# Altium project POETIC_Processor_V2.PrjPcb (part 1 of 2)
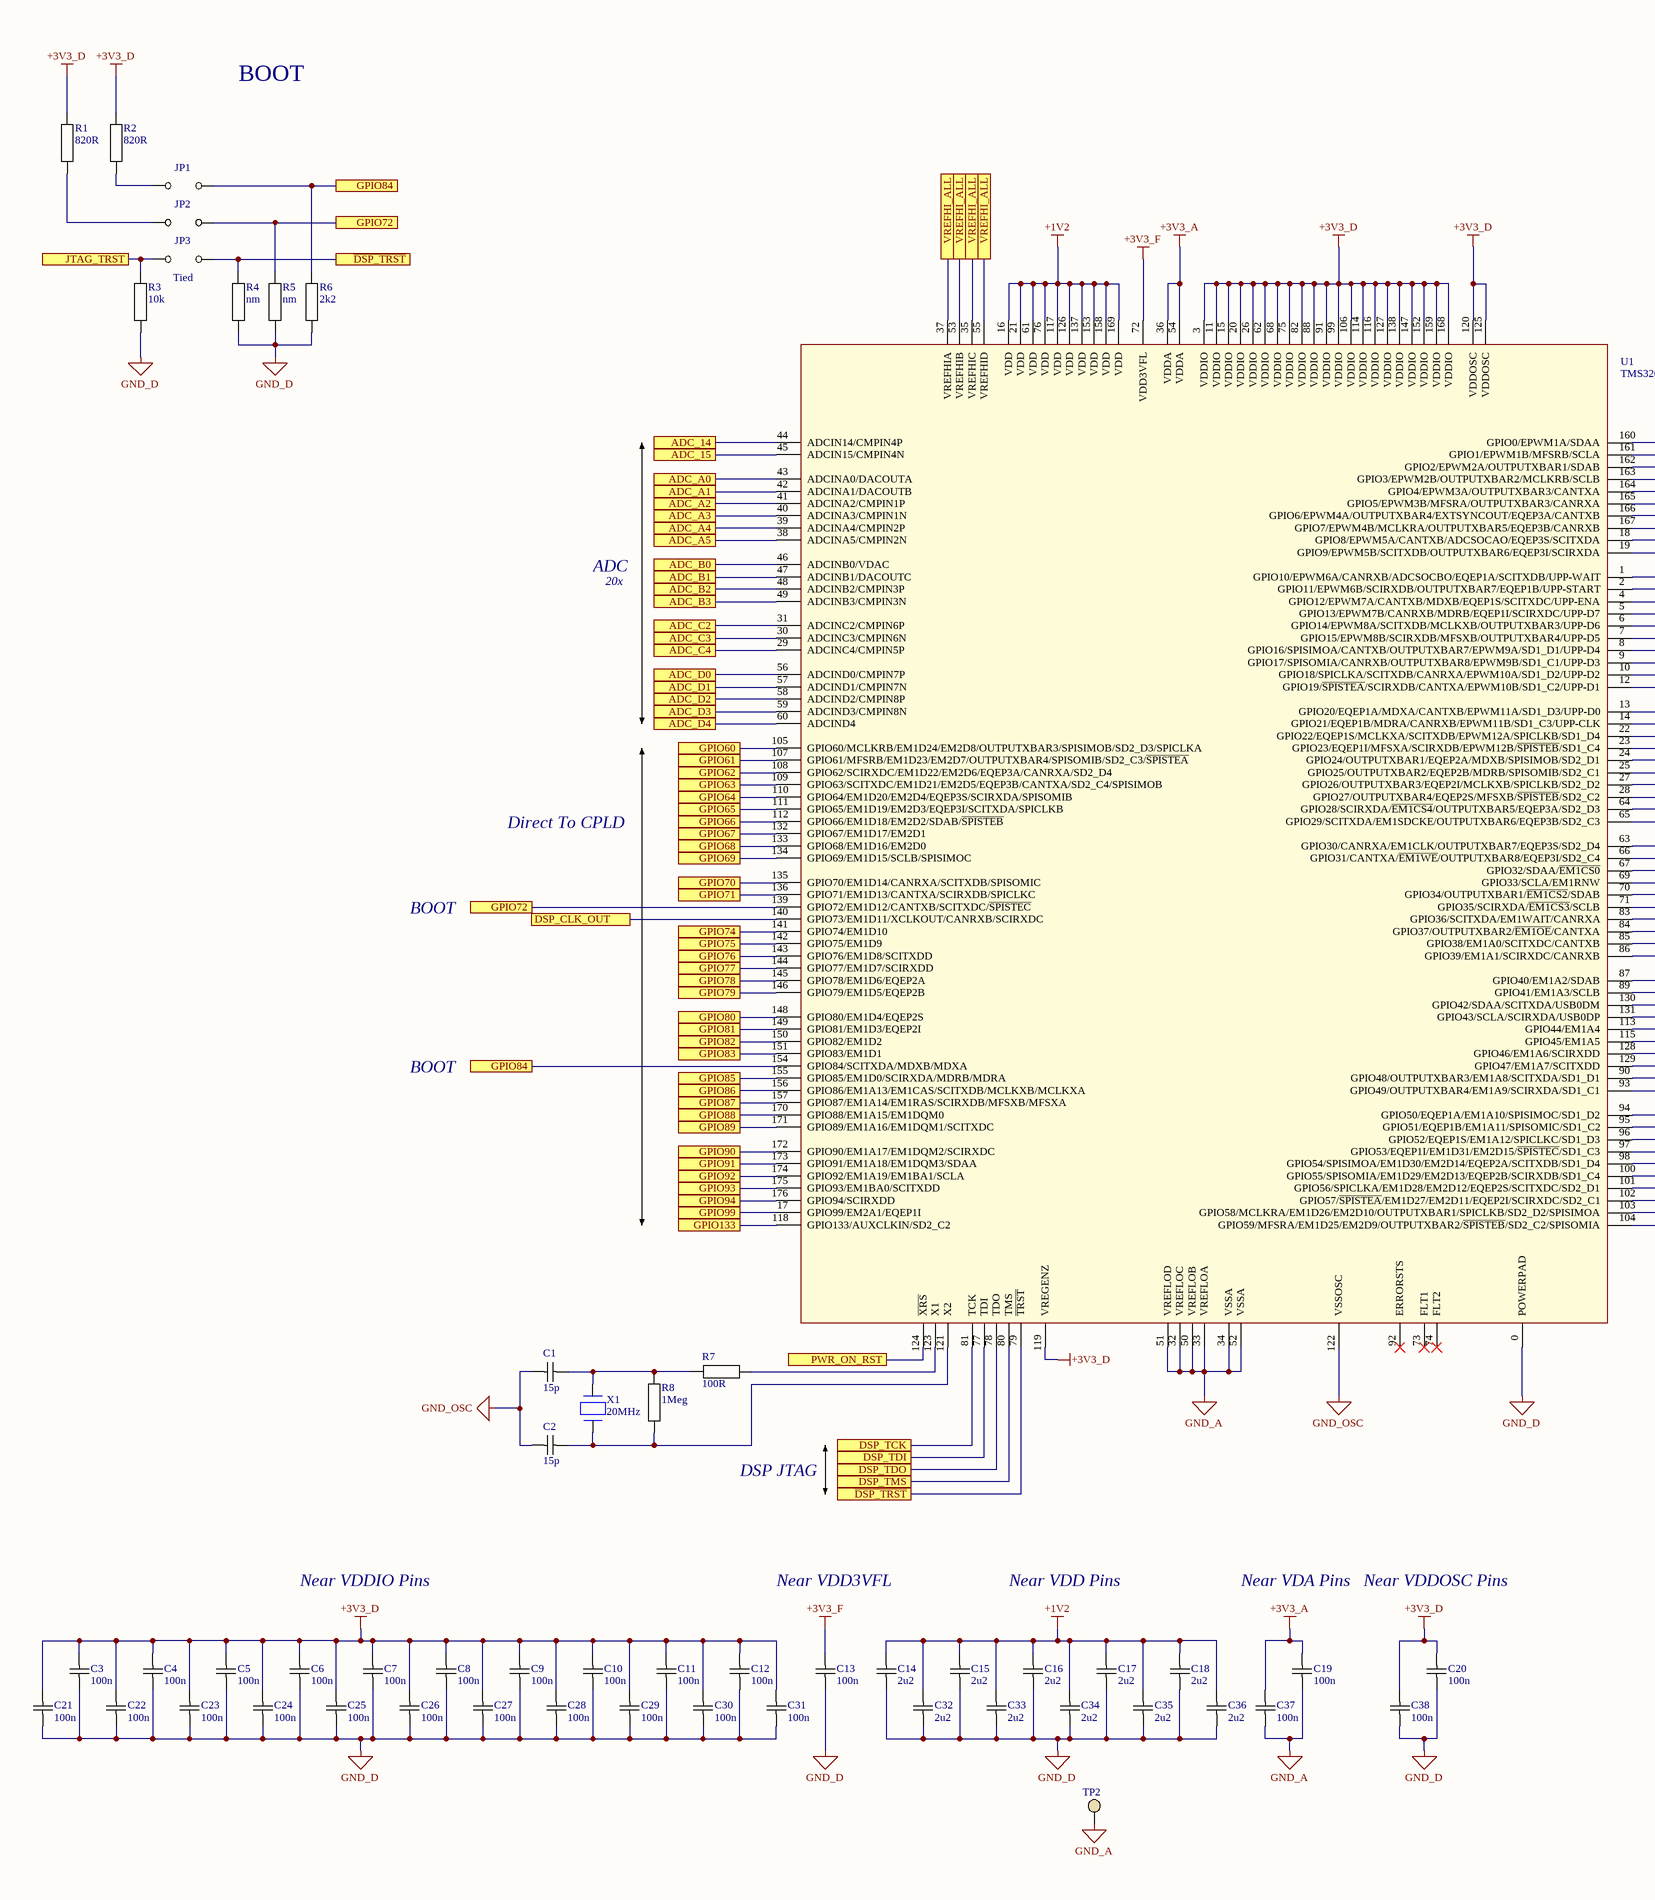
[diagram p0: Processor.SchDoc, left]
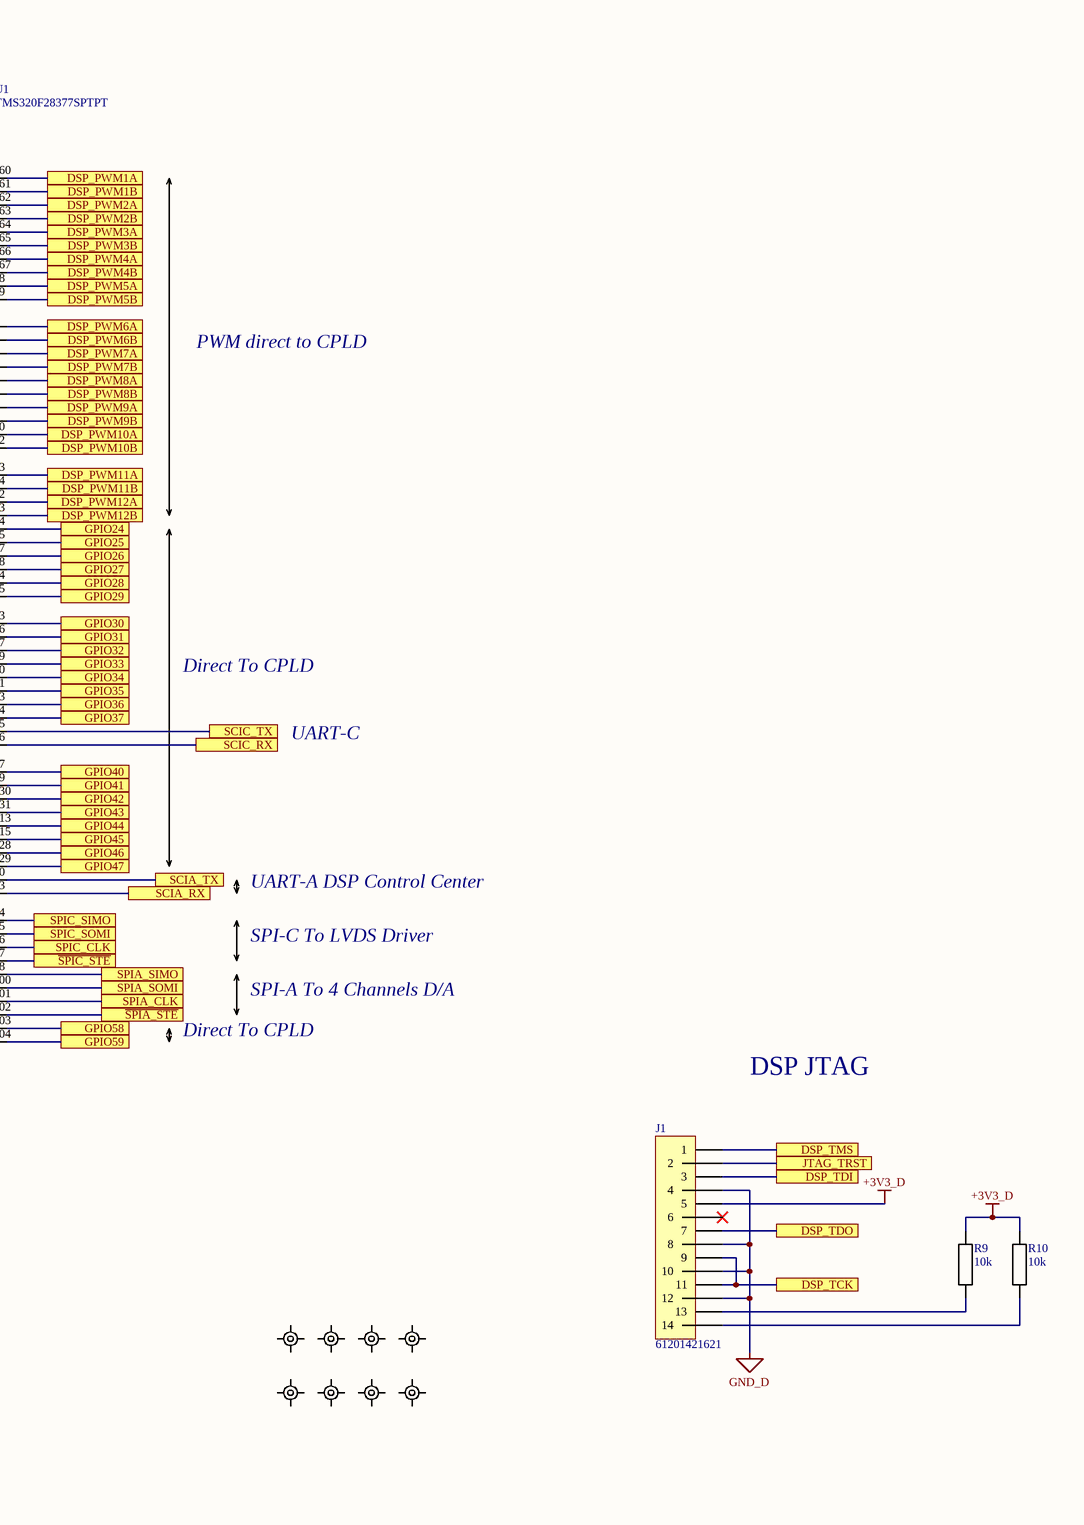
[diagram p1: Processor.SchDoc, right]
PcbDate: 13.03.2018; PcbDesigner: ARC; PcbRevision: 1.0; SchematicDate: 10.05.2019; SchematicDesigner: GIN/GEA; SchematicRevision: 2.0
8 sheets, 405 parts. Net scope: global (net labels, ports and power ports of the same name join across sheets).
Board files: POETIC_Processor_V2.PcbDoc, POETIC_Processor_V2_PANNEL.PcbDoc
Sheets:
  Processor.SchDoc
  Supply.SchDoc
  CPLD.SchDoc
  Connector_0.SchDoc
  AD_0.SchDoc
  AD_1.SchDoc
  AD_2.SchDoc
  Mezz_Board.SchDoc

## Sheet Processor.SchDoc
size A2; Date: Date; CompanyName: HESSO; Engineer: Name; Address1: Route du Rawyl 47; Address2: 1950 Sion; Address3: Switzerland; DocumentNumber: 1; SheetNumber: 1; SheetTotal: 8; ProjectName: Project Name

### Parts
C1  15p  [CAPACITOR 1608 REFLOW]
C2  15p  [CAPACITOR 1608 REFLOW]
C3  100n  [CAPACITOR 1608 REFLOW]
C4  100n  [CAPACITOR 1608 REFLOW]
C5  100n  [CAPACITOR 1608 REFLOW]
C6  100n  [CAPACITOR 1608 REFLOW]
C7  100n  [CAPACITOR 1608 REFLOW]
C8  100n  [CAPACITOR 1608 REFLOW]
C9  100n  [CAPACITOR 1608 REFLOW]
C10  100n  [CAPACITOR 1608 REFLOW]
C11  100n  [CAPACITOR 1608 REFLOW]
C12  100n  [CAPACITOR 1608 REFLOW]
C13  100n  [CAPACITOR 1608 REFLOW]
C14  2u2  [CAPACITOR 1608 REFLOW]
C15  2u2  [CAPACITOR 1608 REFLOW]
C16  2u2  [CAPACITOR 1608 REFLOW]
C17  2u2  [CAPACITOR 1608 REFLOW]
C18  2u2  [CAPACITOR 1608 REFLOW]
C19  100n  [CAPACITOR 1608 REFLOW]
C20  100n  [CAPACITOR 1608 REFLOW]
C21  100n  [CAPACITOR 1608 REFLOW]
C22  100n  [CAPACITOR 1608 REFLOW]
C23  100n  [CAPACITOR 1608 REFLOW]
C24  100n  [CAPACITOR 1608 REFLOW]
C25  100n  [CAPACITOR 1608 REFLOW]
C26  100n  [CAPACITOR 1608 REFLOW]
C27  100n  [CAPACITOR 1608 REFLOW]
C28  100n  [CAPACITOR 1608 REFLOW]
C29  100n  [CAPACITOR 1608 REFLOW]
C30  100n  [CAPACITOR 1608 REFLOW]
C31  100n  [CAPACITOR 1608 REFLOW]
C32  2u2  [CAPACITOR 1608 REFLOW]
C33  2u2  [CAPACITOR 1608 REFLOW]
C34  2u2  [CAPACITOR 1608 REFLOW]
C35  2u2  [CAPACITOR 1608 REFLOW]
C36  2u2  [CAPACITOR 1608 REFLOW]
C37  100n  [CAPACITOR 1608 REFLOW]
C38  100n  [CAPACITOR 1608 REFLOW]
J1  61201421621  [FlatCable2x7 2.54MM Straight TH]
JP1  Tied  [JUMPER2 SMD 1608]  (value not drawn)  (net tie, no BOM)
JP2  Tied  [JUMPER2 SMD 1608]  (value not drawn)  (net tie, no BOM)
JP3  Tied  [JUMPER2 SMD 1608]  (net tie, no BOM)
R1  820R  [RESISTOR 1608 REFLOW]
R2  820R  [RESISTOR 1608 REFLOW]
R3  10k  [RESISTOR 1608 REFLOW]
R4  nm  [RESISTOR 1608 REFLOW]
R5  nm  [RESISTOR 1608 REFLOW]
R6  2k2  [RESISTOR 1608 REFLOW]
R7  100R  [RESISTOR 1608 REFLOW]
R8  1Meg  [RESISTOR 1608 REFLOW]
R9  10k  [RESISTOR 1608 REFLOW]
R10  10k  [RESISTOR 1608 REFLOW]
TP2  *  [Test Point Keystone Miniature BLACK]  (value not drawn)
U1  TMS320F28377SPTPT  [PQFP176 P0.5 C24.2X24.2 H1.5]
X1  20MHz  [Quartz HC49/4H SMX]
Z1  1 - 3  [FIDUCIAL]  (value not drawn)
Z2  1 - 3  [FIDUCIAL]  (value not drawn)
Z3  1 - 3  [FIDUCIAL]  (value not drawn)
Z4  1 - 3  [FIDUCIAL]  (value not drawn)
Z5  1 - 3  [FIDUCIAL]  (value not drawn)
Z6  1 - 3  [FIDUCIAL]  (value not drawn)
Z7  1 - 3  [FIDUCIAL]  (value not drawn)
Z8  1 - 3  [FIDUCIAL]  (value not drawn)

### Ports
ADC_14, ADC_15, ADC_A0, ADC_A1, ADC_A2, ADC_A3, ADC_A4, ADC_A5, ADC_B0, ADC_B1, ADC_B2, ADC_B3, ADC_C2, ADC_C3, ADC_C4, ADC_D0, ADC_D1, ADC_D2, ADC_D3, ADC_D4, DSP_CLK_OUT, DSP_PWM1A, DSP_PWM1B, DSP_PWM2A, DSP_PWM2B, DSP_PWM3A, DSP_PWM3B, DSP_PWM4A, DSP_PWM4B, DSP_PWM5A, DSP_PWM5B, DSP_PWM6A, DSP_PWM6B, DSP_PWM7A, DSP_PWM7B, DSP_PWM8A, DSP_PWM8B, DSP_PWM9A, DSP_PWM9B, DSP_PWM10A, DSP_PWM10B, DSP_PWM11A, DSP_PWM11B, DSP_PWM12A, DSP_PWM12B, DSP_TCK, DSP_TDI, DSP_TDO, DSP_TMS, GPIO24, GPIO25, GPIO26, GPIO27, GPIO28, GPIO29, GPIO30, GPIO31, GPIO32, GPIO33, GPIO34, GPIO35, GPIO36, GPIO37, GPIO40, GPIO41, GPIO42, GPIO43, GPIO44, GPIO45, GPIO46, GPIO47, GPIO58, GPIO59, GPIO60, GPIO61, GPIO62, GPIO63, GPIO64, GPIO65, GPIO66, GPIO67, GPIO68, GPIO69, GPIO70, GPIO71, GPIO72, GPIO74, GPIO75, GPIO76, GPIO77, GPIO78, GPIO79, GPIO80, GPIO81, GPIO82, GPIO83, GPIO84, GPIO85, GPIO86, GPIO87, GPIO88, GPIO89, GPIO90, GPIO91, GPIO92, GPIO93, GPIO94, GPIO99, GPIO133, JTAG_TRST, PWR_ON_RST, SCIA_RX, SCIA_TX, SCIC_RX, SCIC_TX, SPIA_CLK, SPIA_SIMO, SPIA_SOMI, SPIC_CLK, SPIC_SIMO, SPIC_SOMI, VREFHI_ALL, ~{DSP_TRST}, ~{SPIA_STE}, ~{SPIC_STE}

### Nets
+1V2: C14.2 C15.2 C16.2 C17.2 C18.2 C32.2 C33.2 C34.2 C35.2 C36.2 U1.16(VDD) U1.21(VDD) U1.61(VDD) U1.76(VDD) U1.117(VDD) U1.126(VDD) U1.137(VDD) U1.153(VDD) U1.158(VDD) U1.169(VDD)
+3V3_A: C19.2 C37.2 U1.36(VDDA) U1.54(VDDA)
+3V3_D: C3.2 C4.2 C5.2 C6.2 C7.2 C8.2 C9.2 C10.2 C11.2 C12.2 C20.2 C21.2 C22.2 C23.2 C24.2 C25.2 C26.2 C27.2 C28.2 C29.2 C30.2 C31.2 C38.2 J1.5 R1.2 R2.2 R9.2 R10.2 U1.3(VDDIO) U1.11(VDDIO) U1.15(VDDIO) U1.20(VDDIO) U1.26(VDDIO) U1.62(VDDIO) U1.68(VDDIO) U1.75(VDDIO) U1.82(VDDIO) U1.88(VDDIO) U1.91(VDDIO) U1.99(VDDIO) U1.106(VDDIO) U1.114(VDDIO) U1.116(VDDIO) U1.119(VREGENZ) U1.120(VDDOSC) U1.125(VDDOSC) U1.127(VDDIO) U1.138(VDDIO) U1.147(VDDIO) U1.152(VDDIO) U1.159(VDDIO) U1.168(VDDIO)
+3V3_F: C13.2 U1.72(VDD3VFL)
GND_A: C19.1 C37.1 TP2.1 U1.32(VREFLOC) U1.33(VREFLOA) U1.34(VSSA) U1.50(VREFLOB) U1.51(VREFLOD) U1.52(VSSA)
GND_D: C3.1 C4.1 C5.1 C6.1 C7.1 C8.1 C9.1 C10.1 C11.1 C12.1 C13.1 C14.1 C15.1 C16.1 C17.1 C18.1 C20.1 C21.1 C22.1 C23.1 C24.1 C25.1 C26.1 C27.1 C28.1 C29.1 C30.1 C31.1 C32.1 C33.1 C34.1 C35.1 C36.1 C38.1 J1.4 J1.8 J1.10 J1.12 R3.1 R4.1 R5.1 R6.1 U1.0(POWERPAD)
GND_OSC: C1.1 C2.1 U1.122(VSSOSC)
~{SPIA_STE}: U1.102(GPIO57/~{SPISTEA}/EM1D27/EM2D11/EQEP2I/SCIRXDC/SD2_C1) ; port ~{SPIA_STE}
~{SPIC_STE}: U1.97(GPIO53/EQEP1I/EM1D31/EM2D15/~{SPISTEC}/SD1_C3) ; port ~{SPIC_STE}
ADC_14: U1.44(ADCIN14/CMPIN4P) ; port ADC_14
ADC_15: U1.45(ADCIN15/CMPIN4N) ; port ADC_15
ADC_A0: U1.43(ADCINA0/DACOUTA) ; port ADC_A0
ADC_A1: U1.42(ADCINA1/DACOUTB) ; port ADC_A1
ADC_A2: U1.41(ADCINA2/CMPIN1P) ; port ADC_A2
ADC_A3: U1.40(ADCINA3/CMPIN1N) ; port ADC_A3
ADC_A4: U1.39(ADCINA4/CMPIN2P) ; port ADC_A4
ADC_A5: U1.38(ADCINA5/CMPIN2N) ; port ADC_A5
ADC_B0: U1.46(ADCINB0/VDAC) ; port ADC_B0
ADC_B1: U1.47(ADCINB1/DACOUTC) ; port ADC_B1
ADC_B2: U1.48(ADCINB2/CMPIN3P) ; port ADC_B2
ADC_B3: U1.49(ADCINB3/CMPIN3N) ; port ADC_B3
ADC_C2: U1.31(ADCINC2/CMPIN6P) ; port ADC_C2
ADC_C3: U1.30(ADCINC3/CMPIN6N) ; port ADC_C3
ADC_C4: U1.29(ADCINC4/CMPIN5P) ; port ADC_C4
ADC_D0: U1.56(ADCIND0/CMPIN7P) ; port ADC_D0
ADC_D1: U1.57(ADCIND1/CMPIN7N) ; port ADC_D1
ADC_D2: U1.58(ADCIND2/CMPIN8P) ; port ADC_D2
ADC_D3: U1.59(ADCIND3/CMPIN8N) ; port ADC_D3
ADC_D4: U1.60(ADCIND4) ; port ADC_D4
~{DSP_TRST}: JP3.2 R4.2 U1.79(~{TRST}) ; port ~{DSP_TRST}
DSP_CLK_OUT: U1.140(GPIO73/EM1D11/XCLKOUT/CANRXB/SCIRXDC) ; port DSP_CLK_OUT
DSP_PWM1A: U1.160(GPIO0/EPWM1A/SDAA) ; port DSP_PWM1A
DSP_PWM1B: U1.161(GPIO1/EPWM1B/MFSRB/SCLA) ; port DSP_PWM1B
DSP_PWM2A: U1.162(GPIO2/EPWM2A/OUTPUTXBAR1/SDAB) ; port DSP_PWM2A
DSP_PWM2B: U1.163(GPIO3/EPWM2B/OUTPUTXBAR2/MCLKRB/SCLB) ; port DSP_PWM2B
DSP_PWM3A: U1.164(GPIO4/EPWM3A/OUTPUTXBAR3/CANTXA) ; port DSP_PWM3A
DSP_PWM3B: U1.165(GPIO5/EPWM3B/MFSRA/OUTPUTXBAR3/CANRXA) ; port DSP_PWM3B
DSP_PWM4A: U1.166(GPIO6/EPWM4A/OUTPUTXBAR4/EXTSYNCOUT/EQEP3A/CANTXB) ; port DSP_PWM4A
DSP_PWM4B: U1.167(GPIO7/EPWM4B/MCLKRA/OUTPUTXBAR5/EQEP3B/CANRXB) ; port DSP_PWM4B
DSP_PWM5A: U1.18(GPIO8/EPWM5A/CANTXB/ADCSOCAO/EQEP3S/SCITXDA) ; port DSP_PWM5A
DSP_PWM5B: U1.19(GPIO9/EPWM5B/SCITXDB/OUTPUTXBAR6/EQEP3I/SCIRXDA) ; port DSP_PWM5B
DSP_PWM6A: U1.1(GPIO10/EPWM6A/CANRXB/ADCSOCBO/EQEP1A/SCITXDB/UPP-WAIT) ; port DSP_PWM6A
DSP_PWM6B: U1.2(GPIO11/EPWM6B/SCIRXDB/OUTPUTXBAR7/EQEP1B/UPP-START) ; port DSP_PWM6B
DSP_PWM7A: U1.4(GPIO12/EPWM7A/CANTXB/MDXB/EQEP1S/SCITXDC/UPP-ENA) ; port DSP_PWM7A
DSP_PWM7B: U1.5(GPIO13/EPWM7B/CANRXB/MDRB/EQEP1I/SCIRXDC/UPP-D7) ; port DSP_PWM7B
DSP_PWM8A: U1.6(GPIO14/EPWM8A/SCITXDB/MCLKXB/OUTPUTXBAR3/UPP-D6) ; port DSP_PWM8A
DSP_PWM8B: U1.7(GPIO15/EPWM8B/SCIRXDB/MFSXB/OUTPUTXBAR4/UPP-D5) ; port DSP_PWM8B
DSP_PWM9A: U1.8(GPIO16/SPISIMOA/CANTXB/OUTPUTXBAR7/EPWM9A/SD1_D1/UPP-D4) ; port DSP_PWM9A
DSP_PWM9B: U1.9(GPIO17/SPISOMIA/CANRXB/OUTPUTXBAR8/EPWM9B/SD1_C1/UPP-D3) ; port DSP_PWM9B
DSP_PWM10A: U1.10(GPIO18/SPICLKA/SCITXDB/CANRXA/EPWM10A/SD1_D2/UPP-D2) ; port DSP_PWM10A
DSP_PWM10B: U1.12(GPIO19/~{SPISTEA}/SCIRXDB/CANTXA/EPWM10B/SD1_C2/UPP-D1) ; port DSP_PWM10B
DSP_PWM11A: U1.13(GPIO20/EQEP1A/MDXA/CANTXB/EPWM11A/SD1_D3/UPP-D0) ; port DSP_PWM11A
DSP_PWM11B: U1.14(GPIO21/EQEP1B/MDRA/CANRXB/EPWM11B/SD1_C3/UPP-CLK) ; port DSP_PWM11B
DSP_PWM12A: U1.22(GPIO22/EQEP1S/MCLKXA/SCITXDB/EPWM12A/SPICLKB/SD1_D4) ; port DSP_PWM12A
DSP_PWM12B: U1.23(GPIO23/EQEP1I/MFSXA/SCIRXDB/EPWM12B/~{SPISTEB}/SD1_C4) ; port DSP_PWM12B
DSP_TCK: J1.9 J1.11 U1.81(TCK) ; port DSP_TCK
DSP_TDI: J1.3 U1.77(TDI) ; port DSP_TDI
DSP_TDO: J1.7 U1.78(TDO) ; port DSP_TDO
DSP_TMS: J1.1 U1.80(TMS) ; port DSP_TMS
GPIO24: U1.24(GPIO24/OUTPUTXBAR1/EQEP2A/MDXB/SPISIMOB/SD2_D1) ; port GPIO24
GPIO25: U1.25(GPIO25/OUTPUTXBAR2/EQEP2B/MDRB/SPISOMIB/SD2_C1) ; port GPIO25
GPIO26: U1.27(GPIO26/OUTPUTXBAR3/EQEP2I/MCLKXB/SPICLKB/SD2_D2) ; port GPIO26
GPIO27: U1.28(GPIO27/OUTPUTXBAR4/EQEP2S/MFSXB/~{SPISTEB}/SD2_C2) ; port GPIO27
GPIO28: U1.64(GPIO28/SCIRXDA/~{EM1CS4}/OUTPUTXBAR5/EQEP3A/SD2_D3) ; port GPIO28
GPIO29: U1.65(GPIO29/SCITXDA/EM1SDCKE/OUTPUTXBAR6/EQEP3B/SD2_C3) ; port GPIO29
GPIO30: U1.63(GPIO30/CANRXA/EM1CLK/OUTPUTXBAR7/EQEP3S/SD2_D4) ; port GPIO30
GPIO31: U1.66(GPIO31/CANTXA/~{EM1WE}/OUTPUTXBAR8/EQEP3I/SD2_C4) ; port GPIO31
GPIO32: U1.67(GPIO32/SDAA/~{EM1CS0}) ; port GPIO32
GPIO33: U1.69(GPIO33/SCLA/EM1RNW) ; port GPIO33
GPIO34: U1.70(GPIO34/OUTPUTXBAR1/~{EM1CS2}/SDAB) ; port GPIO34
GPIO35: U1.71(GPIO35/SCIRXDA/~{EM1CS3}/SCLB) ; port GPIO35
GPIO36: U1.83(GPIO36/SCITXDA/EM1WAIT/CANRXA) ; port GPIO36
GPIO37: U1.84(GPIO37/OUTPUTXBAR2/~{EM1OE}/CANTXA) ; port GPIO37
GPIO40: U1.87(GPIO40/EM1A2/SDAB) ; port GPIO40
GPIO41: U1.89(GPIO41/EM1A3/SCLB) ; port GPIO41
GPIO42: U1.130(GPIO42/SDAA/SCITXDA/USB0DM) ; port GPIO42
GPIO43: U1.131(GPIO43/SCLA/SCIRXDA/USB0DP) ; port GPIO43
GPIO44: U1.113(GPIO44/EM1A4) ; port GPIO44
GPIO45: U1.115(GPIO45/EM1A5) ; port GPIO45
GPIO46: U1.128(GPIO46/EM1A6/SCIRXDD) ; port GPIO46
GPIO47: U1.129(GPIO47/EM1A7/SCITXDD) ; port GPIO47
GPIO58: U1.103(GPIO58/MCLKRA/EM1D26/EM2D10/OUTPUTXBAR1/SPICLKB/SD2_D2/SPISIMOA) ; port GPIO58
GPIO59: U1.104(GPIO59/MFSRA/EM1D25/EM2D9/OUTPUTXBAR2/~{SPISTEB}/SD2_C2/SPISOMIA) ; port GPIO59
GPIO60: U1.105(GPIO60/MCLKRB/EM1D24/EM2D8/OUTPUTXBAR3/SPISIMOB/SD2_D3/SPICLKA) ; port GPIO60
GPIO61: U1.107(GPIO61/MFSRB/EM1D23/EM2D7/OUTPUTXBAR4/SPISOMIB/SD2_C3/~{SPISTEA}) ; port GPIO61
GPIO62: U1.108(GPIO62/SCIRXDC/EM1D22/EM2D6/EQEP3A/CANRXA/SD2_D4) ; port GPIO62
GPIO63: U1.109(GPIO63/SCITXDC/EM1D21/EM2D5/EQEP3B/CANTXA/SD2_C4/SPISIMOB) ; port GPIO63
GPIO64: U1.110(GPIO64/EM1D20/EM2D4/EQEP3S/SCIRXDA/SPISOMIB) ; port GPIO64
GPIO65: U1.111(GPIO65/EM1D19/EM2D3/EQEP3I/SCITXDA/SPICLKB) ; port GPIO65
GPIO66: U1.112(GPIO66/EM1D18/EM2D2/SDAB/~{SPISTEB}) ; port GPIO66
GPIO67: U1.132(GPIO67/EM1D17/EM2D1) ; port GPIO67
GPIO68: U1.133(GPIO68/EM1D16/EM2D0) ; port GPIO68
GPIO69: U1.134(GPIO69/EM1D15/SCLB/SPISIMOC) ; port GPIO69
GPIO70: U1.135(GPIO70/EM1D14/CANRXA/SCITXDB/SPISOMIC) ; port GPIO70
GPIO71: U1.136(GPIO71/EM1D13/CANTXA/SCIRXDB/SPICLKC) ; port GPIO71
GPIO72: JP2.2 R5.2 U1.139(GPIO72/EM1D12/CANTXB/SCITXDC/~{SPISTEC}) ; port GPIO72
GPIO74: U1.141(GPIO74/EM1D10) ; port GPIO74
GPIO75: U1.142(GPIO75/EM1D9) ; port GPIO75
GPIO76: U1.143(GPIO76/EM1D8/SCITXDD) ; port GPIO76
GPIO77: U1.144(GPIO77/EM1D7/SCIRXDD) ; port GPIO77
GPIO78: U1.145(GPIO78/EM1D6/EQEP2A) ; port GPIO78
GPIO79: U1.146(GPIO79/EM1D5/EQEP2B) ; port GPIO79
GPIO80: U1.148(GPIO80/EM1D4/EQEP2S) ; port GPIO80
GPIO81: U1.149(GPIO81/EM1D3/EQEP2I) ; port GPIO81
GPIO82: U1.150(GPIO82/EM1D2) ; port GPIO82
GPIO83: U1.151(GPIO83/EM1D1) ; port GPIO83
GPIO84: JP1.2 R6.2 U1.154(GPIO84/SCITXDA/MDXB/MDXA) ; port GPIO84
GPIO85: U1.155(GPIO85/EM1D0/SCIRXDA/MDRB/MDRA) ; port GPIO85
GPIO86: U1.156(GPIO86/EM1A13/EM1CAS/SCITXDB/MCLKXB/MCLKXA) ; port GPIO86
GPIO87: U1.157(GPIO87/EM1A14/EM1RAS/SCIRXDB/MFSXB/MFSXA) ; port GPIO87
GPIO88: U1.170(GPIO88/EM1A15/EM1DQM0) ; port GPIO88
GPIO89: U1.171(GPIO89/EM1A16/EM1DQM1/SCITXDC) ; port GPIO89
GPIO90: U1.172(GPIO90/EM1A17/EM1DQM2/SCIRXDC) ; port GPIO90
GPIO91: U1.173(GPIO91/EM1A18/EM1DQM3/SDAA) ; port GPIO91
GPIO92: U1.174(GPIO92/EM1A19/EM1BA1/SCLA) ; port GPIO92
GPIO93: U1.175(GPIO93/EM1BA0/SCITXDD) ; port GPIO93
GPIO94: U1.176(GPIO94/SCIRXDD) ; port GPIO94
GPIO99: U1.17(GPIO99/EM2A1/EQEP1I) ; port GPIO99
GPIO133: U1.118(GPIO133/AUXCLKIN/SD2_C2) ; port GPIO133
JTAG_TRST: J1.2 JP3.1 R3.2 ; port JTAG_TRST
PWR_ON_RST: U1.124(~{XRS}) ; port PWR_ON_RST
SCIA_RX: U1.93(GPIO49/OUTPUTXBAR4/EM1A9/SCIRXDA/SD1_C1) ; port SCIA_RX
SCIA_TX: U1.90(GPIO48/OUTPUTXBAR3/EM1A8/SCITXDA/SD1_D1) ; port SCIA_TX
SCIC_RX: U1.86(GPIO39/EM1A1/SCIRXDC/CANRXB) ; port SCIC_RX
SCIC_TX: U1.85(GPIO38/EM1A0/SCITXDC/CANTXB) ; port SCIC_TX
SPIA_CLK: U1.101(GPIO56/SPICLKA/EM1D28/EM2D12/EQEP2S/SCITXDC/SD2_D1) ; port SPIA_CLK
SPIA_SIMO: U1.98(GPIO54/SPISIMOA/EM1D30/EM2D14/EQEP2A/SCITXDB/SD1_D4) ; port SPIA_SIMO
SPIA_SOMI: U1.100(GPIO55/SPISOMIA/EM1D29/EM2D13/EQEP2B/SCIRXDB/SD1_C4) ; port SPIA_SOMI
SPIC_CLK: U1.96(GPIO52/EQEP1S/EM1A12/SPICLKC/SD1_D3) ; port SPIC_CLK
SPIC_SIMO: U1.94(GPIO50/EQEP1A/EM1A10/SPISIMOC/SD1_D2) ; port SPIC_SIMO
SPIC_SOMI: U1.95(GPIO51/EQEP1B/EM1A11/SPISOMIC/SD1_C2) ; port SPIC_SOMI
VREFHI_ALL: U1.35(VREFHIC) U1.37(VREFHIA) U1.53(VREFHIB) U1.55(VREFHID) ; port VREFHI_ALL
NetC1_2: C1.2 R7.1 R8.2 X1.2
NetC2_2: C2.2 R8.1 U1.121(X2) X1.1
NetJ1_13: J1.13 R9.1
NetJ1_14: J1.14 R10.1
NetJP1_1: JP1.1 R2.1
NetJP2_1: JP2.1 R1.1
NetR7_2: R7.2 U1.123(X1)

Not connected (* = marked no-connect by the designer): J1 6*; U1 73(FLT1)* 74(FLT2)* 92(ERRORSTS)*

### Notes on the sheet
- BOOT
- ADC
- 20x
- PWM direct to CPLD
- Direct To CPLD
- UART-C
- SPI-C To LVDS Driver
- UART-A DSP Control Center
- SPI-A To 4 Channels D/A
- DSP JTAG
- Near VDDIO Pins
- Near VDD3VFL
- Near VDD Pins
- Near VDA Pins
- Near VDDOSC Pins
- Date :
- Revision :
- Sheet
- of
- Design by :

### Library data of the parts
C1-C13 C19-C31 C37 C38 = Capacitor: Capacitor X7R 10% 50V 1608(0603)
  C1 C2: Value: 15p
  C3-C13 C19-C31 C37 C38: Value: 100n
C14-C18 C32-C36 = Capacitor: Capacitor X7R 10% 10V 1608(0603); Value: 2u2
J1 = FlatCable2x7: Manufacturer: Wurth Elektronik; Mouser No.: 710-61201421621; Value: 61201421621
JP1-JP3 = JUMPER 2 POS: Value: Tied
R1-R10 = Resistor: Resistor 1% 50V 100mW 1608(0603)
  R1 R2: Value: 820R
  R3 R9 R10: Value: 10k
  R4 R5: Value: nm
  R6: Value: 2k2
  R7: Value: 100R
  R8: Value: 1Meg
TP2 = Test Point: Value: *
U1 = TMS320F28377S-176P: Manufacturer: Texas Instruments; Value: TMS320F28377SPTPT; Mouser No.: 595-MS320F28377SPTPT
X1 = Quartz HC49/4H SMX
Z1-Z8 = FIDUCIAL: FIDUCIAL Din 1mm Dout 3mm; Value: 1 - 3

## Sheet Supply.SchDoc
size A2; Date: Date; CompanyName: HESSO; Engineer: Name; Address1: Route du Rawyl 47; Address2: 1950 Sion; Address3: Switzerland; DocumentNumber: 2; SheetNumber: 2; SheetTotal: 8; ProjectName: Project Name
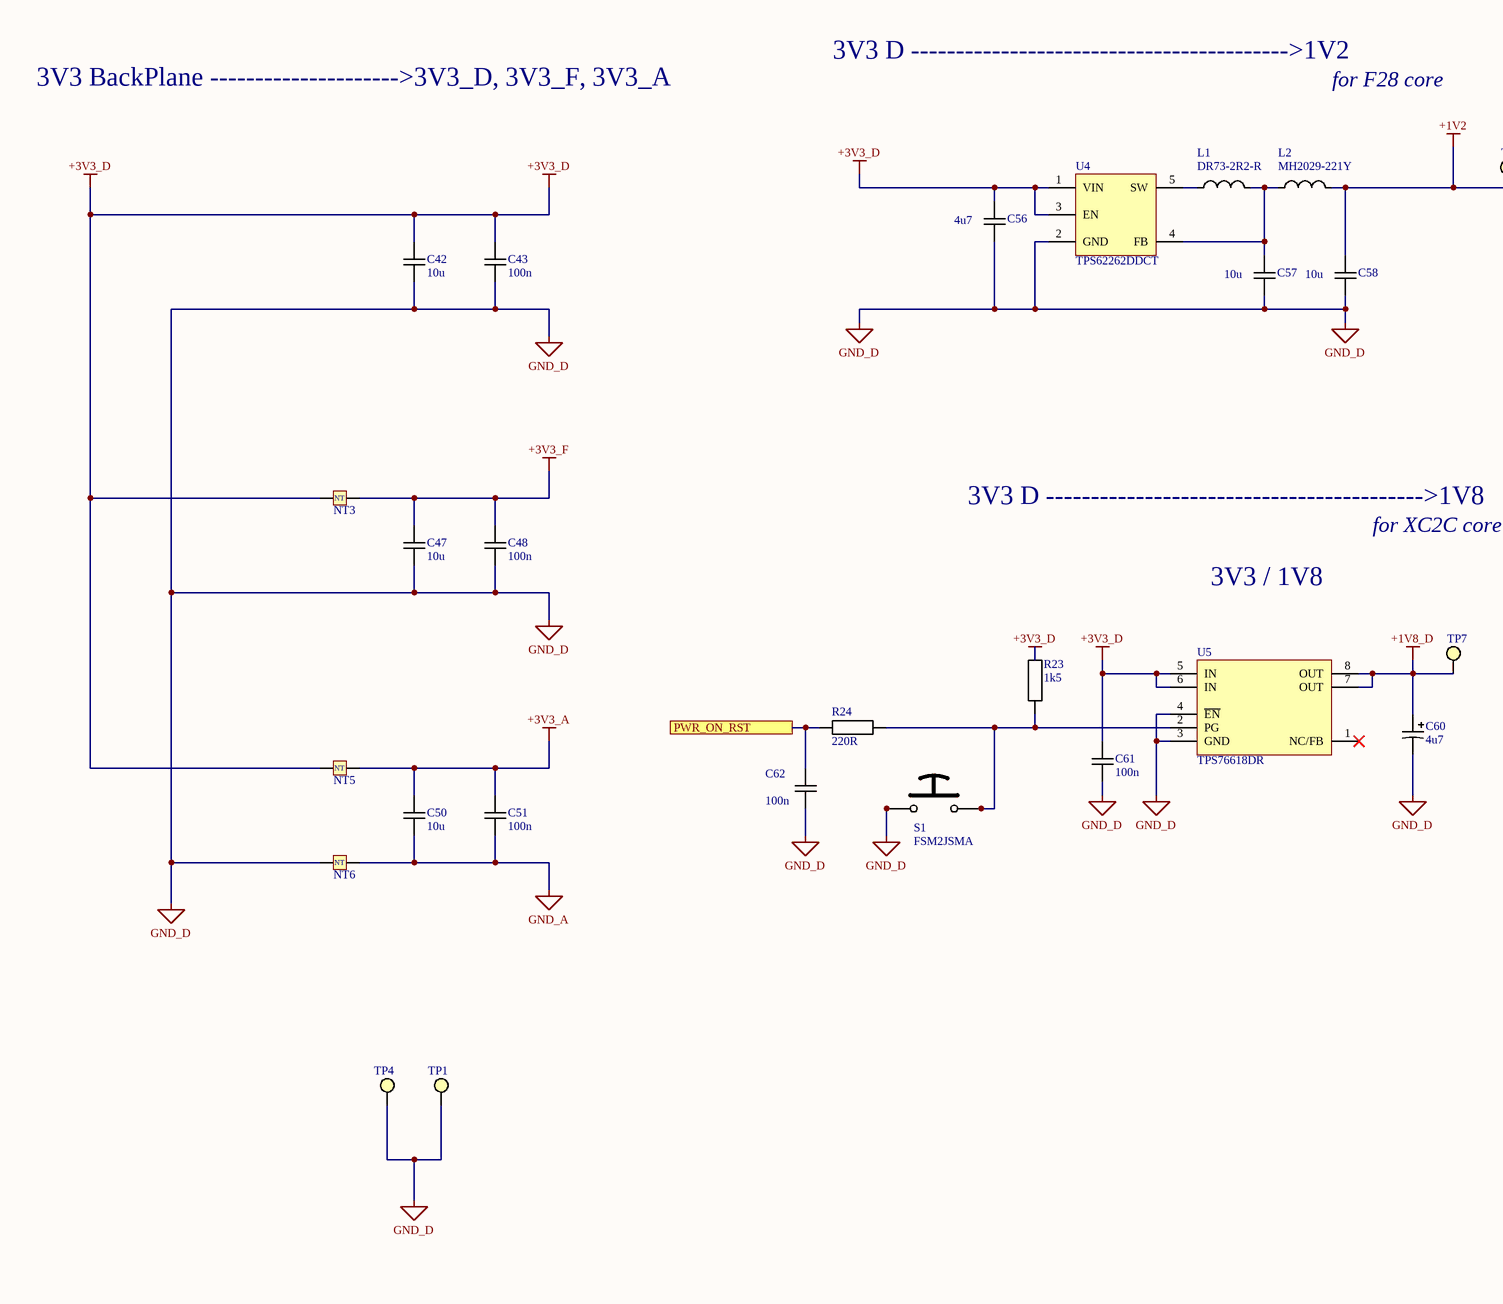
[diagram p2: Supply.SchDoc, left]
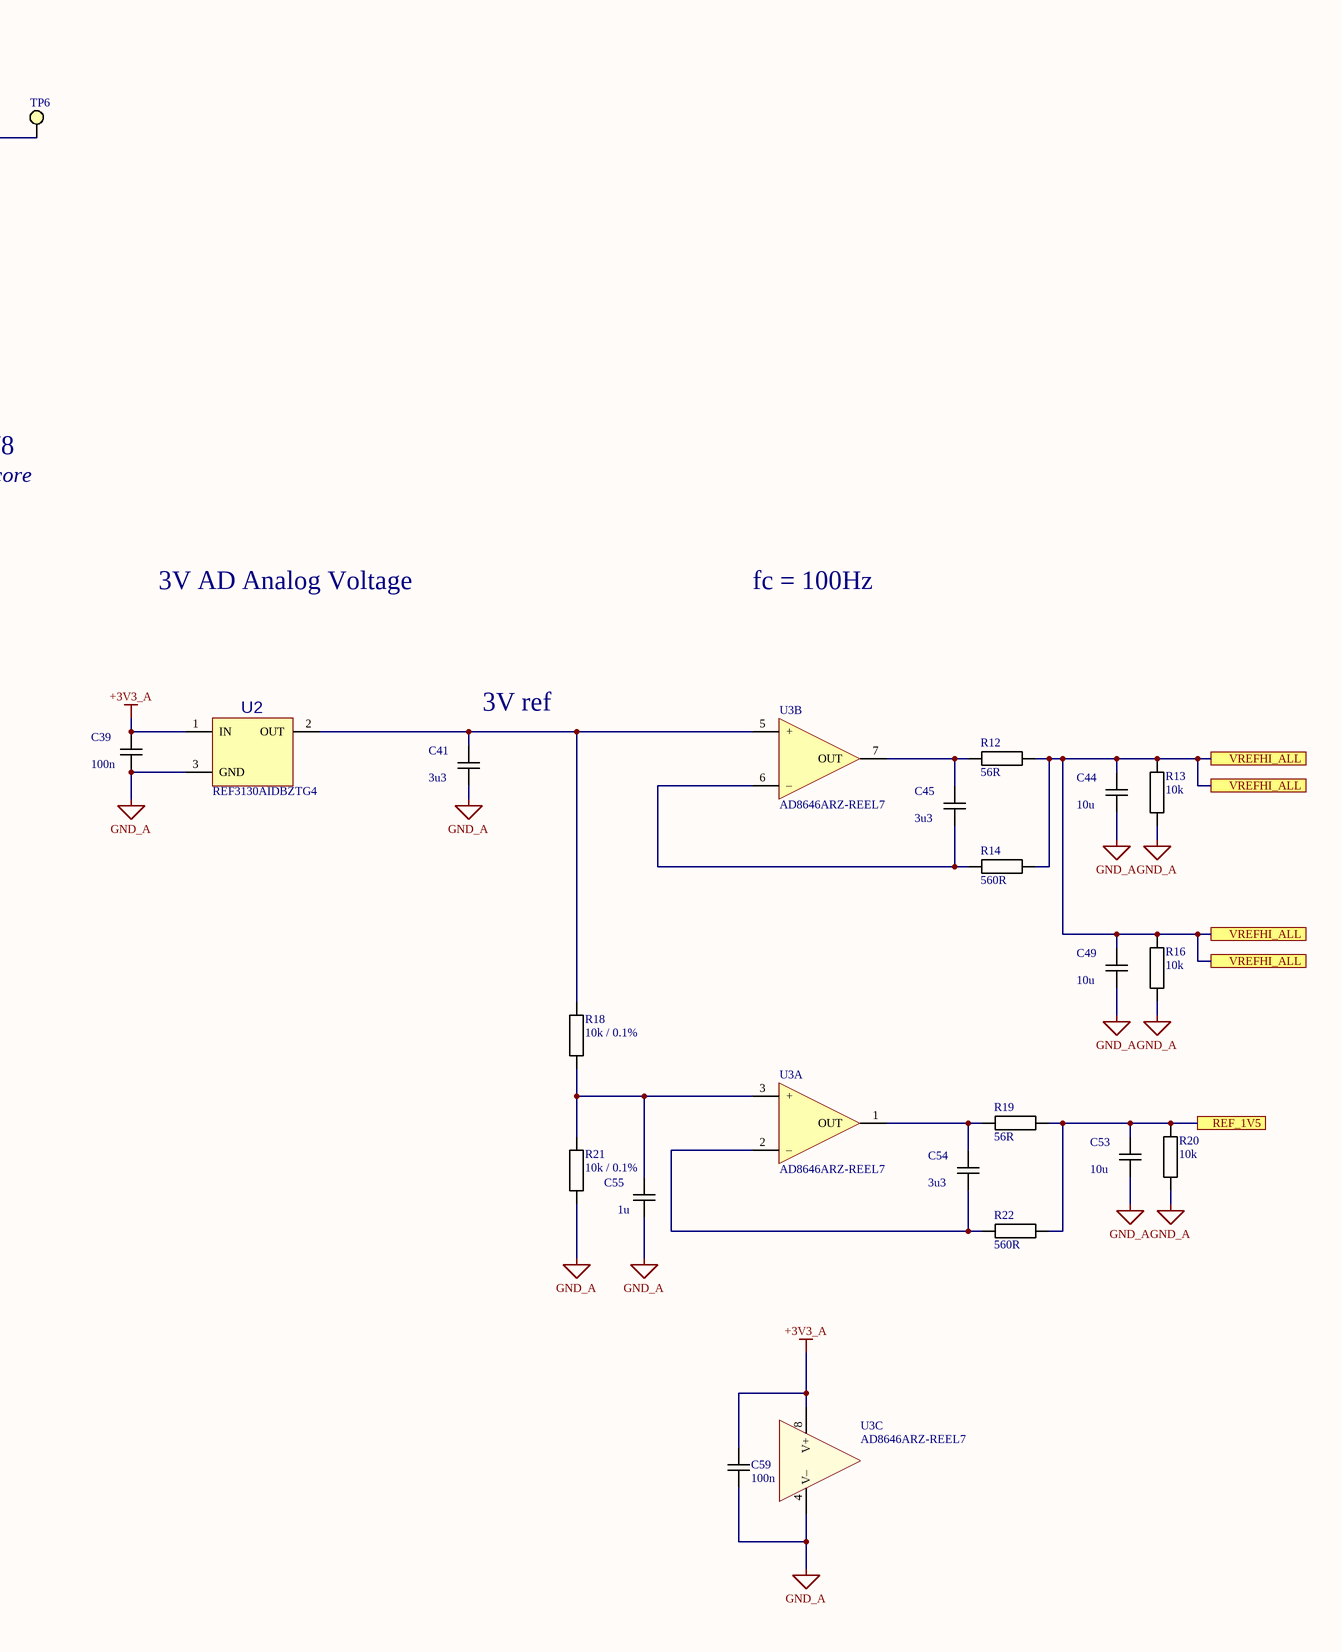
[diagram p3: Supply.SchDoc, right]

### Parts
C39  100n  [CAPACITOR 1608 REFLOW]
C41  3u3  [CAPACITOR 2012 REFLOW]
C42  10u  [CAPACITOR 2012 REFLOW]
C43  100n  [CAPACITOR 2012 REFLOW]
C44  10u  [CAPACITOR 2012 REFLOW]
C45  3u3  [CAPACITOR 2012 REFLOW]
C47  10u  [CAPACITOR 2012 REFLOW]
C48  100n  [CAPACITOR 2012 REFLOW]
C49  10u  [CAPACITOR 2012 REFLOW]
C50  10u  [CAPACITOR 2012 REFLOW]
C51  100n  [CAPACITOR 2012 REFLOW]
C53  10u  [CAPACITOR 2012 REFLOW]
C54  3u3  [CAPACITOR 2012 REFLOW]
C55  1u  [CAPACITOR 2012 REFLOW]
C56  4u7  [CAPACITOR 2012 REFLOW]
C57  10u  [CAPACITOR 2012 REFLOW]
C58  10u  [CAPACITOR 2012 REFLOW]
C59  100n  [CAPACITOR 1608 REFLOW]
C60  4u7  [CAPACITOR POL 3528-21 REFLOW]
C61  100n  [CAPACITOR 1608 REFLOW]
C62  100n  [CAPACITOR 1608 REFLOW]
L1  DR73-2R2-R  [DR73]
L2  MH2029-221Y  [INDUCTOR 2012 REFLOW]
NT3  Net Tie  [NET TIE 1005]  (value not drawn)  (net tie, no BOM)
NT5  Net Tie  [NET TIE 1005]  (value not drawn)  (net tie, no BOM)
NT6  Net Tie  [NET TIE 1005]  (value not drawn)  (net tie, no BOM)
R12  56R  [RESISTOR 1608 REFLOW]
R13  10k  [RESISTOR 1608 REFLOW]
R14  560R  [RESISTOR 1608 REFLOW]
R16  10k  [RESISTOR 1608 REFLOW]
R18  10k / 0.1%  [RESISTOR 1608 REFLOW]
R19  56R  [RESISTOR 1608 REFLOW]
R20  10k  [RESISTOR 1608 REFLOW]
R21  10k / 0.1%  [RESISTOR 1608 REFLOW]
R22  560R  [RESISTOR 1608 REFLOW]
R23  1k5  [RESISTOR 1608 REFLOW]
R24  220R  [RESISTOR 1608 REFLOW]
S1  FSM2JSMA  [Push Button C6.0x6.0 TE FSM-2J-SMA]
TP1  *  [Test Point Keystone Miniature BLACK]  (value not drawn)
TP4  *  [Test Point Keystone Miniature BLACK]  (value not drawn)
TP6  *  [Hole 1.0 D2.0]  (value not drawn)  (no BOM)
TP7  *  [Hole 1.0 D2.0]  (value not drawn)  (no BOM)
U2  REF3130AIDBZTG4  [SOT23 P0.95 C1.6x3.0 H1.3]
U3  AD8646ARZ-REEL7  [SO8 P1.27 C4.0X5.0 H1.75]  (parts A,B,C of 3)
U4  TPS62262DDCT  [SOT23-5 P0.95 C1.6x3.0 H1.3]
U5  TPS76618DR  [SO8 P1.27 C4.0X5.0 H1.75]

### Ports
PWR_ON_RST, REF_1V5, VREFHI_ALL

### Nets
+1V2: C58.2 L2.2 TP6.1
+1V8_D: C60.1 TP7.1 U5.7(OUT) U5.8(OUT)
+3V3_A: C39.2 C50.1 C51.1 C59.2 NT5.2 U2.1(IN) U3.8(V+)
+3V3_D: C42.1 C43.1 C56.2 C61.1 NT3.1 NT5.1 R23.2 U4.1(VIN) U4.3(EN) U5.5(IN) U5.6(IN)
+3V3_F: C47.1 C48.1 NT3.2
GND_A: C39.1 C41.1 C44.1 C49.1 C50.2 C51.2 C53.1 C55.1 C59.1 NT6.2 R13.2 R16.2 R20.2 R21.2 U2.3(GND) U3.4(V–)
GND_D: C42.2 C43.2 C47.2 C48.2 C56.1 C57.1 C58.1 C60.2 C61.2 C62.1 NT6.1 S1.1 S1.2 TP1.1 TP4.1 U4.2(GND) U5.3(GND) U5.4(~{EN})
PWR_ON_RST: C62.2 R24.1 ; port PWR_ON_RST
REF_1V5: C53.2 R19.1 R20.1 R22.1 ; port REF_1V5
VREFHI_ALL: C44.2 C49.2 R12.1 R13.1 R14.1 R16.1 ; port VREFHI_ALL
NetC41_2: C41.2 R18.2 U2.2(OUT) U3.5(+)
NetC45_1: C45.1 R14.2 U3.6(–)
NetC45_2: C45.2 R12.2 U3.7(OUT)
NetC54_1: C54.1 R22.2 U3.2(–)
NetC54_2: C54.2 R19.2 U3.1(OUT)
NetC55_2: C55.2 R18.1 R21.1 U3.3(+)
NetC57_2: C57.2 L1.2 L2.1 U4.4(FB)
NetL1_1: L1.1 U4.5(SW)
NetR23_1: R23.1 R24.2 S1.3 S1.4 U5.2(PG)

Not connected (* = marked no-connect by the designer): U5 1(NC/FB)*

### Notes on the sheet
- 3V3 D ------------------------------------------>1V2
- 3V3 BackPlane --------------------->3V3_D, 3V3_F, 3V3_A
- for F28 core
- 3V3 D ------------------------------------------>1V8
- for XC2C core
- 3V3 / 1V8
- 3V AD Analog Voltage
- fc = 100Hz
- (near C41) 3V ref
- Date :
- Revision :
- Sheet
- of
- Design by :
- (in symbol Net Tie) NT

### Library data of the parts
C39 C59 C61 C62 = Capacitor: Capacitor X7R 10% 50V 1608(0603); Value: 100n
C41 C42 C44 C45 C47 C49 C50 C53-C58 = Capacitor: Capacitor X7R 10% 10V 2012(0805)
  C41 C45 C54: Value: 3u3
  C42 C44 C47 C49 C50 C53 C57 C58: Value: 10u
  C55: Value: 1u
  C56: Value: 4u7
C43 C48 C51 = Capacitor: Capacitor X7R 10% 50V 2012(0805); Value: 100n
C60 = Capacitor Polarized: Capacitor Tantalum 10 % 10V 3528(1311-TAJ-B); Value: 4u7
L1 = Inductor: Manufacturer: Coiltronics / Eaton; Info: 2u2, 4.15A, 16mΩ; Mouser No.: 704-DR73-2R2-R; Value: DR73-2R2-R
L2 = Inductor: Manufacturer: Bourns; Info: 220u, 2A, 220Ω@100Mhz; Mouser No.: 652-MH2029-221Y; Value: MH2029-221Y
NT3 NT5 NT6 = Net Tie: Connection for 2 different NETNAME
R12-R14 R16 R18-R24 = Resistor: Resistor 1% 50V 100mW 1608(0603)
  R12 R19: Value: 56R
  R13 R16 R20: Value: 10k
  R14 R22: Value: 560R
  R18 R21: Value: 10k / 0.1%
  R23: Value: 1k5
  R24: Value: 220R
S1 = Push Button 4Pins: Push Button, 4 pins, 2 poles parrallèle; Manufacturer: TE Connectivity / Alcoswitch; Value: FSM2JSMA; Mouser No.: 506-FSM2JSMA
TP1 TP4 = Test Point: Value: *
TP6 TP7 = Hole: Value: *
U2 = REFERENCE SOT23 IN-OUT- GND: Generic Positive Voltage Reference; Manufacturer: Texas Instruments; Value: REF3130AIDBZTG4; Mouser No.: 595-REF3130AIDBZTG4
U3 = OPA DUAL: Generic dual OPA 8 pins; Manufacturer: Analog Devices; Value: AD8646ARZ-REEL7; Mouser No.: 584-AD8646ARZ-R7
U4 = TPS6226x: 2.25-MHz 600-mA Step Down Converter in 2 x 2 SOT Package; Manufacturer: Texas Instruments; Value: TPS62262DDCT; Mouser No.: 595-TPS62262DDCT
U5 = TPS766__D: Ultra Low Quiescent Current 250mA, Low Dropout Regulator; Manufacturer: Texas Instruments; Value: TPS76618DR; Mouser No.: 595-TPS76618DR

## Sheet CPLD.SchDoc
size A2; Date: Date; CompanyName: HESSO; Engineer: Name; Address1: Route du Rawyl 47; Address2: 1950 Sion; Address3: Switzerland; DocumentNumber: 3; SheetNumber: 3; SheetTotal: 8; ProjectName: Project Name
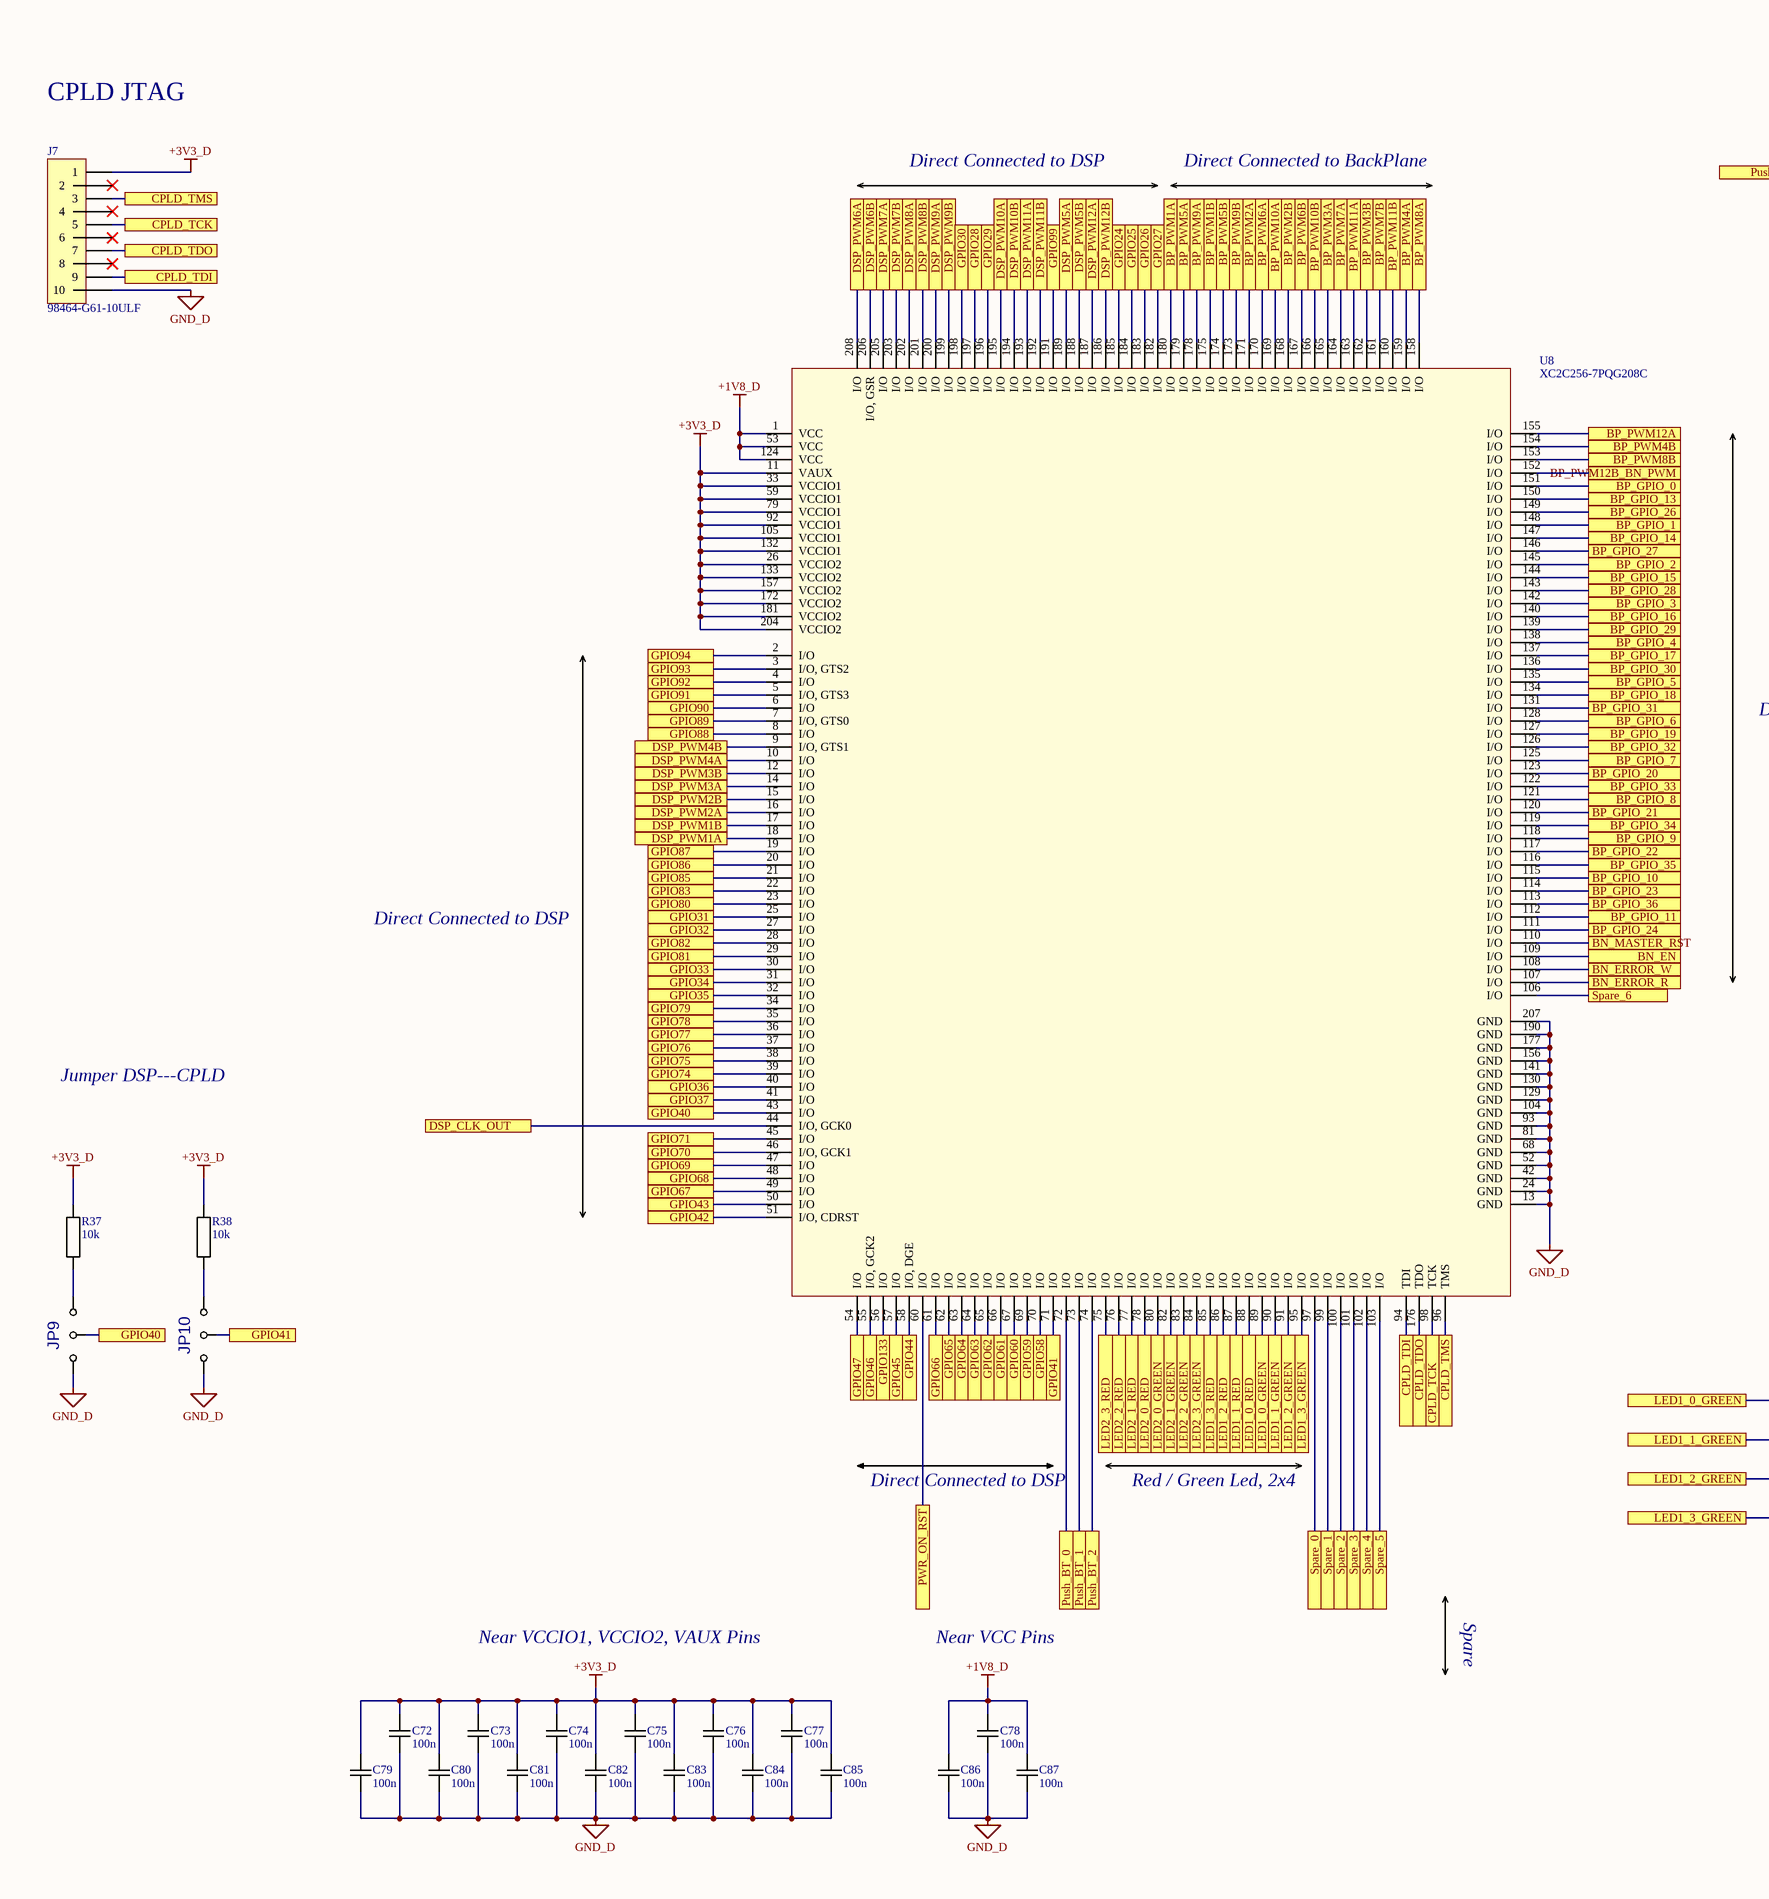
[diagram p4: CPLD.SchDoc, left]
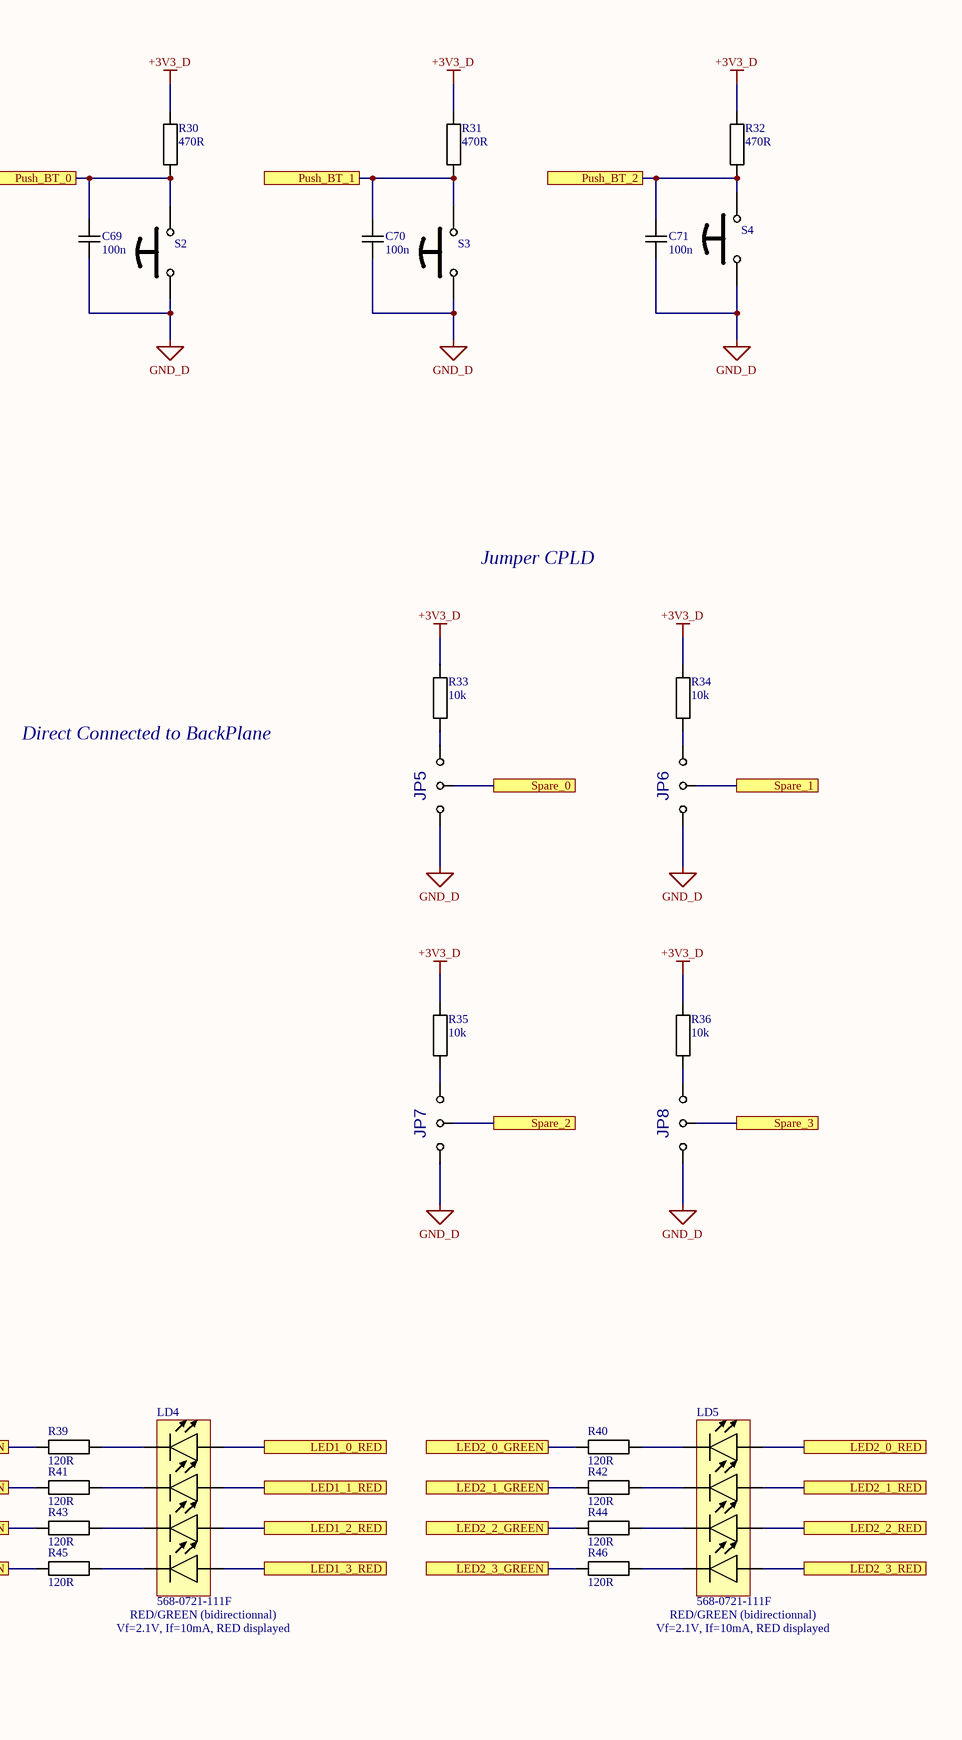
[diagram p5: CPLD.SchDoc, right]

### Parts
C69  100n  [CAPACITOR 2012 REFLOW]
C70  100n  [CAPACITOR 2012 REFLOW]
C71  100n  [CAPACITOR 2012 REFLOW]
C72  100n  [CAPACITOR 1608 REFLOW]
C73  100n  [CAPACITOR 1608 REFLOW]
C74  100n  [CAPACITOR 1608 REFLOW]
C75  100n  [CAPACITOR 1608 REFLOW]
C76  100n  [CAPACITOR 1608 REFLOW]
C77  100n  [CAPACITOR 1608 REFLOW]
C78  100n  [CAPACITOR 1608 REFLOW]
C79  100n  [CAPACITOR 1608 REFLOW]
C80  100n  [CAPACITOR 1608 REFLOW]
C81  100n  [CAPACITOR 1608 REFLOW]
C82  100n  [CAPACITOR 1608 REFLOW]
C83  100n  [CAPACITOR 1608 REFLOW]
C84  100n  [CAPACITOR 1608 REFLOW]
C85  100n  [CAPACITOR 1608 REFLOW]
C86  100n  [CAPACITOR 1608 REFLOW]
C87  100n  [CAPACITOR 1608 REFLOW]
J7  98464-G61-10ULF  [FlatCable2x5 2MM Right Angle TH FCI 98614-G61-10ULF]
JP5  {Value}  [JUMPER3 TH]  (value not drawn)
JP6  {Value}  [JUMPER3 TH]  (value not drawn)
JP7  {Value}  [JUMPER3 TH]  (value not drawn)
JP8  {Value}  [JUMPER3 TH]  (value not drawn)
JP9  {Value}  [JUMPER3 TH]  (value not drawn)
JP10  {Value}  [JUMPER3 TH]  (value not drawn)
LD4  568-0721-111F  [LED Dialight 568-0721-111]
LD5  568-0721-111F  [LED Dialight 568-0721-111]
R30  470R  [RESISTOR 2012 REFLOW]
R31  470R  [RESISTOR 2012 REFLOW]
R32  470R  [RESISTOR 2012 REFLOW]
R33  10k  [RESISTOR 2012 REFLOW]
R34  10k  [RESISTOR 2012 REFLOW]
R35  10k  [RESISTOR 2012 REFLOW]
R36  10k  [RESISTOR 2012 REFLOW]
R37  10k  [RESISTOR 2012 REFLOW]
R38  10k  [RESISTOR 2012 REFLOW]
R39  120R  [RESISTOR 1608 REFLOW]
R40  120R  [RESISTOR 1608 REFLOW]
R41  120R  [RESISTOR 1608 REFLOW]
R42  120R  [RESISTOR 1608 REFLOW]
R43  120R  [RESISTOR 1608 REFLOW]
R44  120R  [RESISTOR 1608 REFLOW]
R45  120R  [RESISTOR 1608 REFLOW]
R46  120R  [RESISTOR 1608 REFLOW]
S2  FSMRA4JH04  [Push Button C7.1x3.7 TE FSMRA4JH]  (value not drawn)
S3  FSMRA4JH04  [Push Button C7.1x3.7 TE FSMRA4JH]  (value not drawn)
S4  FSMRA4JH04  [Push Button C7.1x3.7 TE FSMRA4JH]  (value not drawn)
U8  XC2C256-7PQG208C  [PQFP208 P0.5 C28.0X28.0 H3.7]

### Ports
BN_EN, BN_ERROR_R, BN_ERROR_W, BN_MASTER_RST, BP_GPIO_0, BP_GPIO_1, BP_GPIO_2, BP_GPIO_3, BP_GPIO_4, BP_GPIO_5, BP_GPIO_6, BP_GPIO_7, BP_GPIO_8, BP_GPIO_9, BP_GPIO_10, BP_GPIO_11, BP_GPIO_13, BP_GPIO_14, BP_GPIO_15, BP_GPIO_16, BP_GPIO_17, BP_GPIO_18, BP_GPIO_19, BP_GPIO_20, BP_GPIO_21, BP_GPIO_22, BP_GPIO_23, BP_GPIO_24, BP_GPIO_26, BP_GPIO_27, BP_GPIO_28, BP_GPIO_29, BP_GPIO_30, BP_GPIO_31, BP_GPIO_32, BP_GPIO_33, BP_GPIO_34, BP_GPIO_35, BP_GPIO_36, BP_PWM1A, BP_PWM1B, BP_PWM2A, BP_PWM2B, BP_PWM3A, BP_PWM3B, BP_PWM4A, BP_PWM4B, BP_PWM5A, BP_PWM5B, BP_PWM6A, BP_PWM6B, BP_PWM7A, BP_PWM7B, BP_PWM8A, BP_PWM8B, BP_PWM9A, BP_PWM9B, BP_PWM10A, BP_PWM10B, BP_PWM11A, BP_PWM11B, BP_PWM12A, BP_PWM12B_BN_PWM, CPLD_TCK, CPLD_TDI, CPLD_TDO, CPLD_TMS, DSP_CLK_OUT, DSP_PWM1A, DSP_PWM1B, DSP_PWM2A, DSP_PWM2B, DSP_PWM3A, DSP_PWM3B, DSP_PWM4A, DSP_PWM4B, DSP_PWM5A, DSP_PWM5B, DSP_PWM6A, DSP_PWM6B, DSP_PWM7A, DSP_PWM7B, DSP_PWM8A, DSP_PWM8B, DSP_PWM9A, DSP_PWM9B, DSP_PWM10A, DSP_PWM10B, DSP_PWM11A, DSP_PWM11B, DSP_PWM12A, DSP_PWM12B, GPIO24, GPIO25, GPIO26, GPIO27, GPIO28, GPIO29, GPIO30, GPIO31, GPIO32, GPIO33, GPIO34, GPIO35, GPIO36, GPIO37, GPIO40, GPIO41, GPIO42, GPIO43, GPIO44, GPIO45, GPIO46, GPIO47, GPIO58, GPIO59, GPIO60, GPIO61, GPIO62, GPIO63, GPIO64, GPIO65, GPIO66, GPIO67, GPIO68, GPIO69, GPIO70, GPIO71, GPIO74, GPIO75, GPIO76, GPIO77, GPIO78, GPIO79, GPIO80, GPIO81, GPIO82, GPIO83, GPIO85, GPIO86, GPIO87, GPIO88, GPIO89, GPIO90, GPIO91, GPIO92, GPIO93, GPIO94, GPIO99, GPIO133, LED1_0_GREEN, LED1_0_RED, LED1_1_GREEN, LED1_1_RED, LED1_2_GREEN, LED1_2_RED, LED1_3_GREEN, LED1_3_RED, LED2_0_GREEN, LED2_0_RED, LED2_1_GREEN, LED2_1_RED, LED2_2_GREEN, LED2_2_RED, LED2_3_GREEN, LED2_3_RED, Push_BT_0, Push_BT_1, Push_BT_2, PWR_ON_RST, Spare_0, Spare_1, Spare_2, Spare_3, Spare_4, Spare_5, Spare_6

### Nets
+1V8_D: C78.2 C86.2 C87.2 U8.1(VCC) U8.53(VCC) U8.124(VCC)
+3V3_D: C72.2 C73.2 C74.2 C75.2 C76.2 C77.2 C79.2 C80.2 C81.2 C82.2 C83.2 C84.2 C85.2 J7.1 R30.2 R31.2 R32.2 R33.2 R34.2 R35.2 R36.2 R37.1 R38.1 U8.11(VAUX) U8.26(VCCIO2) U8.33(VCCIO1) U8.59(VCCIO1) U8.79(VCCIO1) U8.92(VCCIO1) U8.105(VCCIO1) U8.132(VCCIO1) U8.133(VCCIO2) U8.157(VCCIO2) U8.172(VCCIO2) U8.181(VCCIO2) U8.204(VCCIO2)
GND_D: C69.1 C70.1 C71.1 C72.1 C73.1 C74.1 C75.1 C76.1 C77.1 C78.1 C79.1 C80.1 C81.1 C82.1 C83.1 C84.1 C85.1 C86.1 C87.1 J7.10 JP5.1 JP6.1 JP7.1 JP8.1 JP9.1 JP10.1 S2.1 S3.1 S4.1 U8.13(GND) U8.24(GND) U8.42(GND) U8.52(GND) U8.68(GND) U8.81(GND) U8.93(GND) U8.104(GND) U8.129(GND) U8.130(GND) U8.141(GND) U8.156(GND) U8.177(GND) U8.190(GND) U8.207(GND)
BN_EN: U8.109(I/O) ; port BN_EN
BN_ERROR_R: U8.107(I/O) ; port BN_ERROR_R
BN_ERROR_W: U8.108(I/O) ; port BN_ERROR_W
BN_MASTER_RST: U8.110(I/O) ; port BN_MASTER_RST
BP_GPIO_0: U8.151(I/O) ; port BP_GPIO_0
BP_GPIO_1: U8.148(I/O) ; port BP_GPIO_1
BP_GPIO_2: U8.145(I/O) ; port BP_GPIO_2
BP_GPIO_3: U8.142(I/O) ; port BP_GPIO_3
BP_GPIO_4: U8.138(I/O) ; port BP_GPIO_4
BP_GPIO_5: U8.135(I/O) ; port BP_GPIO_5
BP_GPIO_6: U8.128(I/O) ; port BP_GPIO_6
BP_GPIO_7: U8.125(I/O) ; port BP_GPIO_7
BP_GPIO_8: U8.121(I/O) ; port BP_GPIO_8
BP_GPIO_9: U8.118(I/O) ; port BP_GPIO_9
BP_GPIO_10: U8.115(I/O) ; port BP_GPIO_10
BP_GPIO_11: U8.112(I/O) ; port BP_GPIO_11
BP_GPIO_13: U8.150(I/O) ; port BP_GPIO_13
BP_GPIO_14: U8.147(I/O) ; port BP_GPIO_14
BP_GPIO_15: U8.144(I/O) ; port BP_GPIO_15
BP_GPIO_16: U8.140(I/O) ; port BP_GPIO_16
BP_GPIO_17: U8.137(I/O) ; port BP_GPIO_17
BP_GPIO_18: U8.134(I/O) ; port BP_GPIO_18
BP_GPIO_19: U8.127(I/O) ; port BP_GPIO_19
BP_GPIO_20: U8.123(I/O) ; port BP_GPIO_20
BP_GPIO_21: U8.120(I/O) ; port BP_GPIO_21
BP_GPIO_22: U8.117(I/O) ; port BP_GPIO_22
BP_GPIO_23: U8.114(I/O) ; port BP_GPIO_23
BP_GPIO_24: U8.111(I/O) ; port BP_GPIO_24
BP_GPIO_26: U8.149(I/O) ; port BP_GPIO_26
BP_GPIO_27: U8.146(I/O) ; port BP_GPIO_27
BP_GPIO_28: U8.143(I/O) ; port BP_GPIO_28
BP_GPIO_29: U8.139(I/O) ; port BP_GPIO_29
BP_GPIO_30: U8.136(I/O) ; port BP_GPIO_30
BP_GPIO_31: U8.131(I/O) ; port BP_GPIO_31
BP_GPIO_32: U8.126(I/O) ; port BP_GPIO_32
BP_GPIO_33: U8.122(I/O) ; port BP_GPIO_33
BP_GPIO_34: U8.119(I/O) ; port BP_GPIO_34
BP_GPIO_35: U8.116(I/O) ; port BP_GPIO_35
BP_GPIO_36: U8.113(I/O) ; port BP_GPIO_36
BP_PWM1A: U8.180(I/O) ; port BP_PWM1A
BP_PWM1B: U8.175(I/O) ; port BP_PWM1B
BP_PWM2A: U8.171(I/O) ; port BP_PWM2A
BP_PWM2B: U8.168(I/O) ; port BP_PWM2B
BP_PWM3A: U8.165(I/O) ; port BP_PWM3A
BP_PWM3B: U8.162(I/O) ; port BP_PWM3B
BP_PWM4A: U8.159(I/O) ; port BP_PWM4A
BP_PWM4B: U8.154(I/O) ; port BP_PWM4B
BP_PWM5A: U8.179(I/O) ; port BP_PWM5A
BP_PWM5B: U8.174(I/O) ; port BP_PWM5B
BP_PWM6A: U8.170(I/O) ; port BP_PWM6A
BP_PWM6B: U8.167(I/O) ; port BP_PWM6B
BP_PWM7A: U8.164(I/O) ; port BP_PWM7A
BP_PWM7B: U8.161(I/O) ; port BP_PWM7B
BP_PWM8A: U8.158(I/O) ; port BP_PWM8A
BP_PWM8B: U8.153(I/O) ; port BP_PWM8B
BP_PWM9A: U8.178(I/O) ; port BP_PWM9A
BP_PWM9B: U8.173(I/O) ; port BP_PWM9B
BP_PWM10A: U8.169(I/O) ; port BP_PWM10A
BP_PWM10B: U8.166(I/O) ; port BP_PWM10B
BP_PWM11A: U8.163(I/O) ; port BP_PWM11A
BP_PWM11B: U8.160(I/O) ; port BP_PWM11B
BP_PWM12A: U8.155(I/O) ; port BP_PWM12A
BP_PWM12B_BN_PWM: U8.152(I/O) ; port BP_PWM12B_BN_PWM
CPLD_TCK: J7.5 U8.98(TCK) ; port CPLD_TCK
CPLD_TDI: J7.9 U8.94(TDI) ; port CPLD_TDI
CPLD_TDO: J7.7 U8.176(TDO) ; port CPLD_TDO
CPLD_TMS: J7.3 U8.96(TMS) ; port CPLD_TMS
DSP_CLK_OUT: U8.44(I/O,_GCK0) ; port DSP_CLK_OUT
DSP_PWM1A: U8.18(I/O) ; port DSP_PWM1A
DSP_PWM1B: U8.17(I/O) ; port DSP_PWM1B
DSP_PWM2A: U8.16(I/O) ; port DSP_PWM2A
DSP_PWM2B: U8.15(I/O) ; port DSP_PWM2B
DSP_PWM3A: U8.14(I/O) ; port DSP_PWM3A
DSP_PWM3B: U8.12(I/O) ; port DSP_PWM3B
DSP_PWM4A: U8.10(I/O) ; port DSP_PWM4A
DSP_PWM4B: U8.9(I/O,_GTS1) ; port DSP_PWM4B
DSP_PWM5A: U8.189(I/O) ; port DSP_PWM5A
DSP_PWM5B: U8.188(I/O) ; port DSP_PWM5B
DSP_PWM6A: U8.208(I/O) ; port DSP_PWM6A
DSP_PWM6B: U8.206(I/O,_GSR) ; port DSP_PWM6B
DSP_PWM7A: U8.205(I/O) ; port DSP_PWM7A
DSP_PWM7B: U8.203(I/O) ; port DSP_PWM7B
DSP_PWM8A: U8.202(I/O) ; port DSP_PWM8A
DSP_PWM8B: U8.201(I/O) ; port DSP_PWM8B
DSP_PWM9A: U8.200(I/O) ; port DSP_PWM9A
DSP_PWM9B: U8.199(I/O) ; port DSP_PWM9B
DSP_PWM10A: U8.195(I/O) ; port DSP_PWM10A
DSP_PWM10B: U8.194(I/O) ; port DSP_PWM10B
DSP_PWM11A: U8.193(I/O) ; port DSP_PWM11A
DSP_PWM11B: U8.192(I/O) ; port DSP_PWM11B
DSP_PWM12A: U8.187(I/O) ; port DSP_PWM12A
DSP_PWM12B: U8.186(I/O) ; port DSP_PWM12B
GPIO24: U8.185(I/O) ; port GPIO24
GPIO25: U8.184(I/O) ; port GPIO25
GPIO26: U8.183(I/O) ; port GPIO26
GPIO27: U8.182(I/O) ; port GPIO27
GPIO28: U8.197(I/O) ; port GPIO28
GPIO29: U8.196(I/O) ; port GPIO29
GPIO30: U8.198(I/O) ; port GPIO30
GPIO31: U8.25(I/O) ; port GPIO31
GPIO32: U8.27(I/O) ; port GPIO32
GPIO33: U8.30(I/O) ; port GPIO33
GPIO34: U8.31(I/O) ; port GPIO34
GPIO35: U8.32(I/O) ; port GPIO35
GPIO36: U8.40(I/O) ; port GPIO36
GPIO37: U8.41(I/O) ; port GPIO37
GPIO40: JP9.2 U8.43(I/O) ; port GPIO40
GPIO41: JP10.2 U8.71(I/O) ; port GPIO41
GPIO42: U8.51(I/O,_CDRST) ; port GPIO42
GPIO43: U8.50(I/O) ; port GPIO43
GPIO44: U8.58(I/O,_DGE) ; port GPIO44
GPIO45: U8.57(I/O) ; port GPIO45
GPIO46: U8.55(I/O,_GCK2) ; port GPIO46
GPIO47: U8.54(I/O) ; port GPIO47
GPIO58: U8.70(I/O) ; port GPIO58
GPIO59: U8.69(I/O) ; port GPIO59
GPIO60: U8.67(I/O) ; port GPIO60
GPIO61: U8.66(I/O) ; port GPIO61
GPIO62: U8.65(I/O) ; port GPIO62
GPIO63: U8.64(I/O) ; port GPIO63
GPIO64: U8.63(I/O) ; port GPIO64
GPIO65: U8.62(I/O) ; port GPIO65
GPIO66: U8.61(I/O) ; port GPIO66
GPIO67: U8.49(I/O) ; port GPIO67
GPIO68: U8.48(I/O) ; port GPIO68
GPIO69: U8.47(I/O) ; port GPIO69
GPIO70: U8.46(I/O,_GCK1) ; port GPIO70
GPIO71: U8.45(I/O) ; port GPIO71
GPIO74: U8.39(I/O) ; port GPIO74
GPIO75: U8.38(I/O) ; port GPIO75
GPIO76: U8.37(I/O) ; port GPIO76
GPIO77: U8.36(I/O) ; port GPIO77
GPIO78: U8.35(I/O) ; port GPIO78
GPIO79: U8.34(I/O) ; port GPIO79
GPIO80: U8.23(I/O) ; port GPIO80
GPIO81: U8.29(I/O) ; port GPIO81
GPIO82: U8.28(I/O) ; port GPIO82
GPIO83: U8.22(I/O) ; port GPIO83
GPIO85: U8.21(I/O) ; port GPIO85
GPIO86: U8.20(I/O) ; port GPIO86
GPIO87: U8.19(I/O) ; port GPIO87
GPIO88: U8.8(I/O) ; port GPIO88
GPIO89: U8.7(I/O,_GTS0) ; port GPIO89
GPIO90: U8.6(I/O) ; port GPIO90
GPIO91: U8.5(I/O,_GTS3) ; port GPIO91
GPIO92: U8.4(I/O) ; port GPIO92
GPIO93: U8.3(I/O,_GTS2) ; port GPIO93
GPIO94: U8.2(I/O) ; port GPIO94
GPIO99: U8.191(I/O) ; port GPIO99
GPIO133: U8.56(I/O) ; port GPIO133
LED1_0_GREEN: R39.1 U8.89(I/O) ; port LED1_0_GREEN
LED1_0_RED: LD4.8(A) U8.88(I/O) ; port LED1_0_RED
LED1_1_GREEN: R41.1 U8.90(I/O) ; port LED1_1_GREEN
LED1_1_RED: LD4.6(A) U8.87(I/O) ; port LED1_1_RED
LED1_2_GREEN: R43.1 U8.91(I/O) ; port LED1_2_GREEN
LED1_2_RED: LD4.4(A) U8.86(I/O) ; port LED1_2_RED
LED1_3_GREEN: R45.1 U8.95(I/O) ; port LED1_3_GREEN
LED1_3_RED: LD4.2(A) U8.85(I/O) ; port LED1_3_RED
LED2_0_GREEN: R40.1 U8.80(I/O) ; port LED2_0_GREEN
LED2_0_RED: LD5.8(A) U8.78(I/O) ; port LED2_0_RED
LED2_1_GREEN: R42.1 U8.82(I/O) ; port LED2_1_GREEN
LED2_1_RED: LD5.6(A) U8.77(I/O) ; port LED2_1_RED
LED2_2_GREEN: R44.1 U8.83(I/O) ; port LED2_2_GREEN
LED2_2_RED: LD5.4(A) U8.76(I/O) ; port LED2_2_RED
LED2_3_GREEN: R46.1 U8.84(I/O) ; port LED2_3_GREEN
LED2_3_RED: LD5.2(A) U8.75(I/O) ; port LED2_3_RED
Push_BT_0: C69.2 R30.1 S2.2 U8.72(I/O) ; port Push_BT_0
Push_BT_1: C70.2 R31.1 S3.2 U8.73(I/O) ; port Push_BT_1
Push_BT_2: C71.2 R32.1 S4.2 U8.74(I/O) ; port Push_BT_2
PWR_ON_RST: U8.60(I/O) ; port PWR_ON_RST
Spare_0: JP5.2 U8.97(I/O) ; port Spare_0
Spare_1: JP6.2 U8.99(I/O) ; port Spare_1
Spare_2: JP7.2 U8.100(I/O) ; port Spare_2
Spare_3: JP8.2 U8.101(I/O) ; port Spare_3
Spare_4: U8.102(I/O) ; port Spare_4
Spare_5: U8.103(I/O) ; port Spare_5
Spare_6: U8.106(I/O) ; port Spare_6
NetJP5_3: JP5.3 R33.1
NetJP6_3: JP6.3 R34.1
NetJP7_3: JP7.3 R35.1
NetJP8_3: JP8.3 R36.1
NetJP9_3: JP9.3 R37.2
NetJP10_3: JP10.3 R38.2
NetLD4_1: LD4.1(C) R45.2
NetLD4_3: LD4.3(C) R43.2
NetLD4_5: LD4.5(C) R41.2
NetLD4_7: LD4.7(C) R39.2
NetLD5_1: LD5.1(C) R46.2
NetLD5_3: LD5.3(C) R44.2
NetLD5_5: LD5.5(C) R42.2
NetLD5_7: LD5.7(C) R40.2

Not connected (* = marked no-connect by the designer): J7 2* 4* 6* 8*

### Notes on the sheet
- CPLD JTAG
- Direct Connected to DSP
- Direct Connected to BackPlane
- Jumper CPLD
- Jumper DSP---CPLD
- Red / Green Led, 2x4
- Spare
- Vf=2.1V, If=10mA, RED displayed
- RED/GREEN (bidirectionnal)
- Near VCCIO1, VCCIO2, VAUX Pins
- Near VCC Pins
- Date :
- Revision :
- Sheet
- of
- Design by :

### Library data of the parts
C69-C71 = Capacitor: Capacitor X7R 10% 50V 2012(0805); Value: 100n
C72-C87 = Capacitor: Capacitor X7R 10% 50V 1608(0603); Value: 100n
J7 = FlatCable2x5: Manufacturer: Amphenol FCI; Mouser No.: 649-98464-G6110ULF; Value: 98464-G61-10ULF
JP5-JP10 = JUMPER 3 POS: Value: {Value}
LD4 LD5 = LED Dialight 568-0721-111F: Value: 568-0721-111F; Manufacturer: Dialight; Mouser No.: 645-568-0721-111F
R30-R38 = Resistor: Resistor 1% 50V 125mW 2012(0805)
  R30-R32: Value: 470R
  R33-R38: Value: 10k
R39-R46 = Resistor: Resistor 1% 50V 100mW 1608(0603); Value: 120R
S2-S4 = Push Button 2Pins: Push Button, 2 pins; Manufacturer: TE Connectivity / Alcoswitch; Value: FSMRA4JH04; Mouser No.: 506-FSMRA4JH04
U8 = XC2C256-PQFP208: XC2C256 CoolRunner-II CPLD; Manufacturer: Xilinx; value: XC2C256-7PQG208C; Digikey No.: 122-1411-ND

## Sheet Connector_0.SchDoc
size A2; Date: Date; CompanyName: HESSO; Engineer: Name; Address1: Route du Rawyl 47; Address2: 1950 Sion; Address3: Switzerland; DocumentNumber: 4; SheetNumber: 4; SheetTotal: 8; ProjectName: Project Name
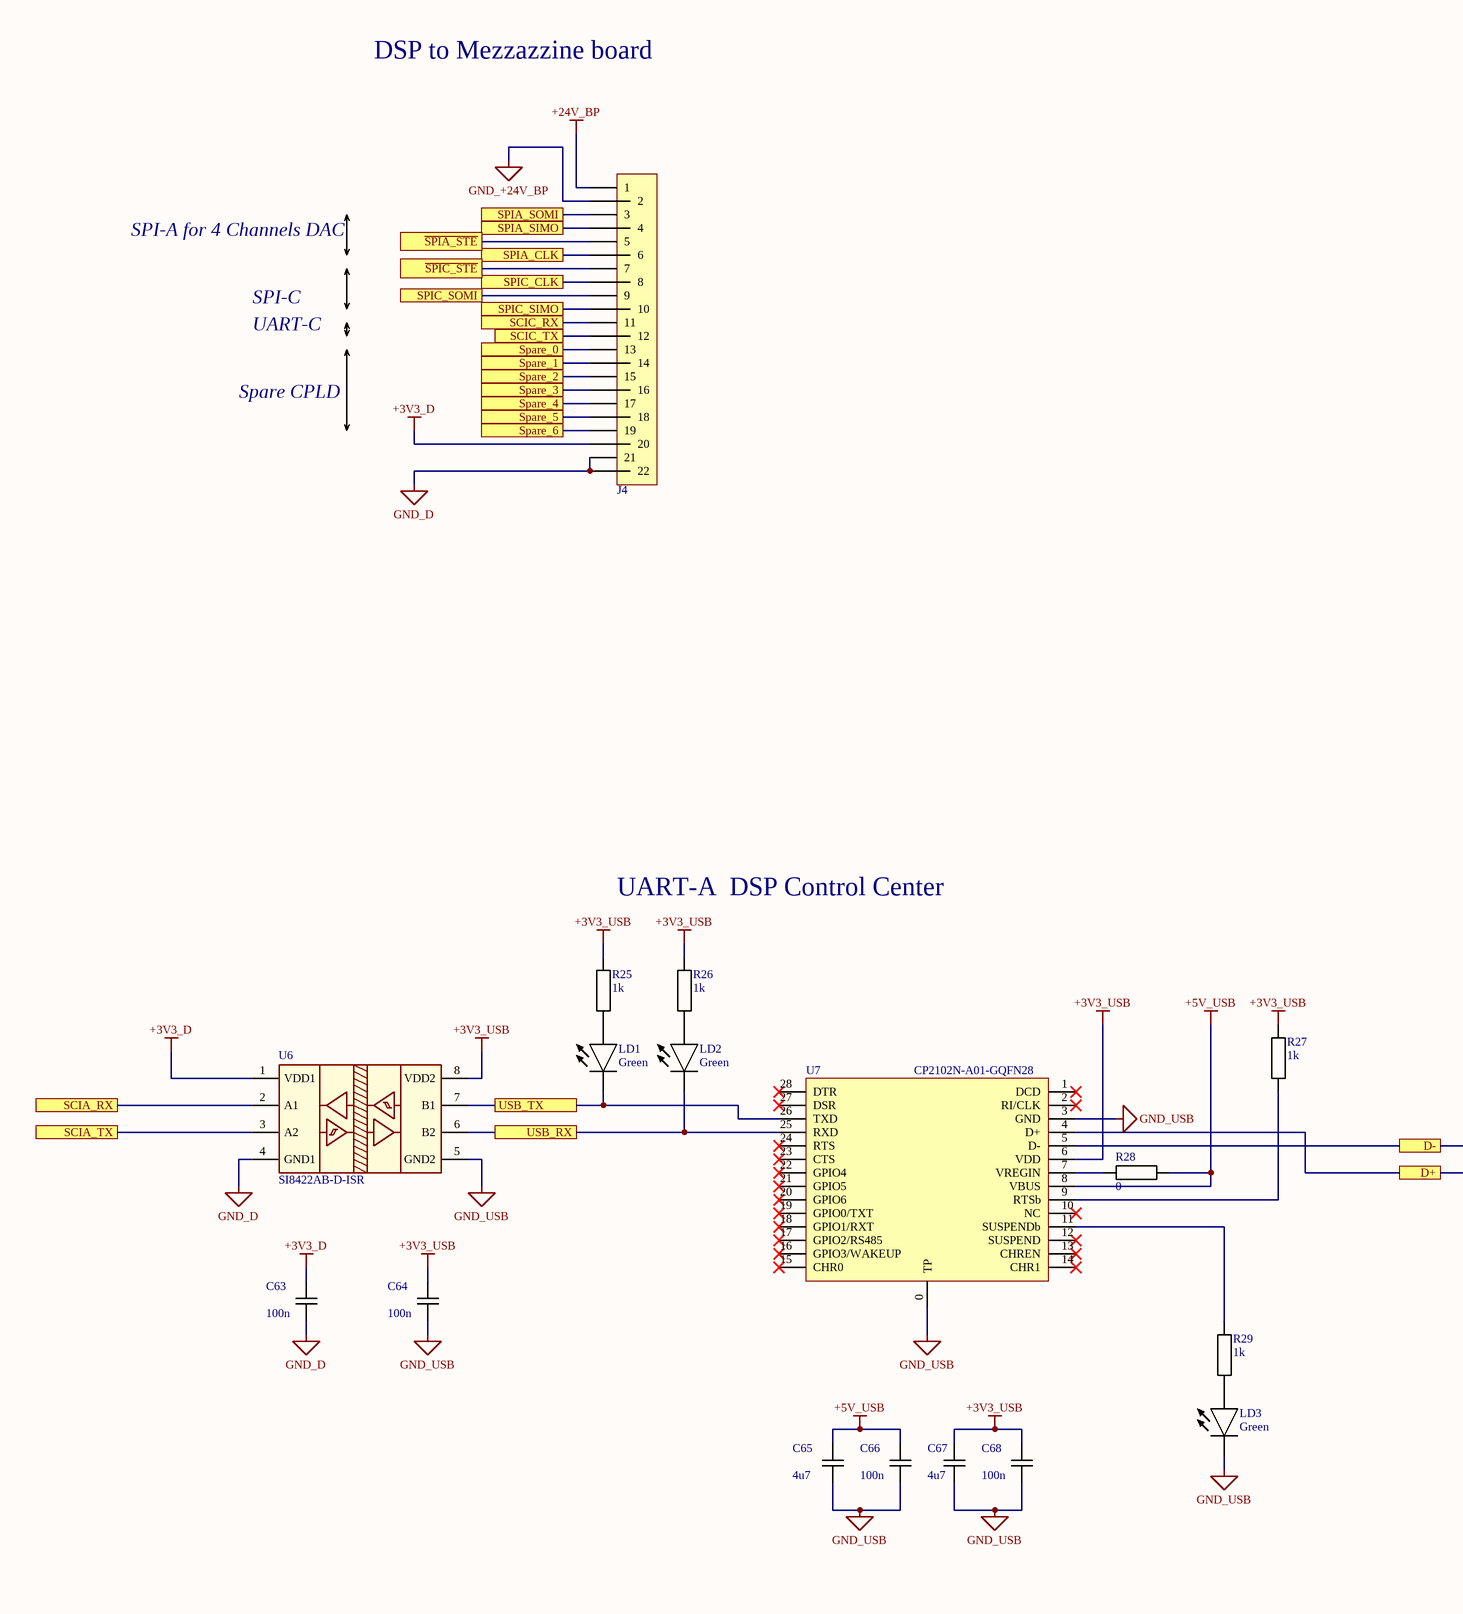
[diagram p6: Connector_0.SchDoc, left]
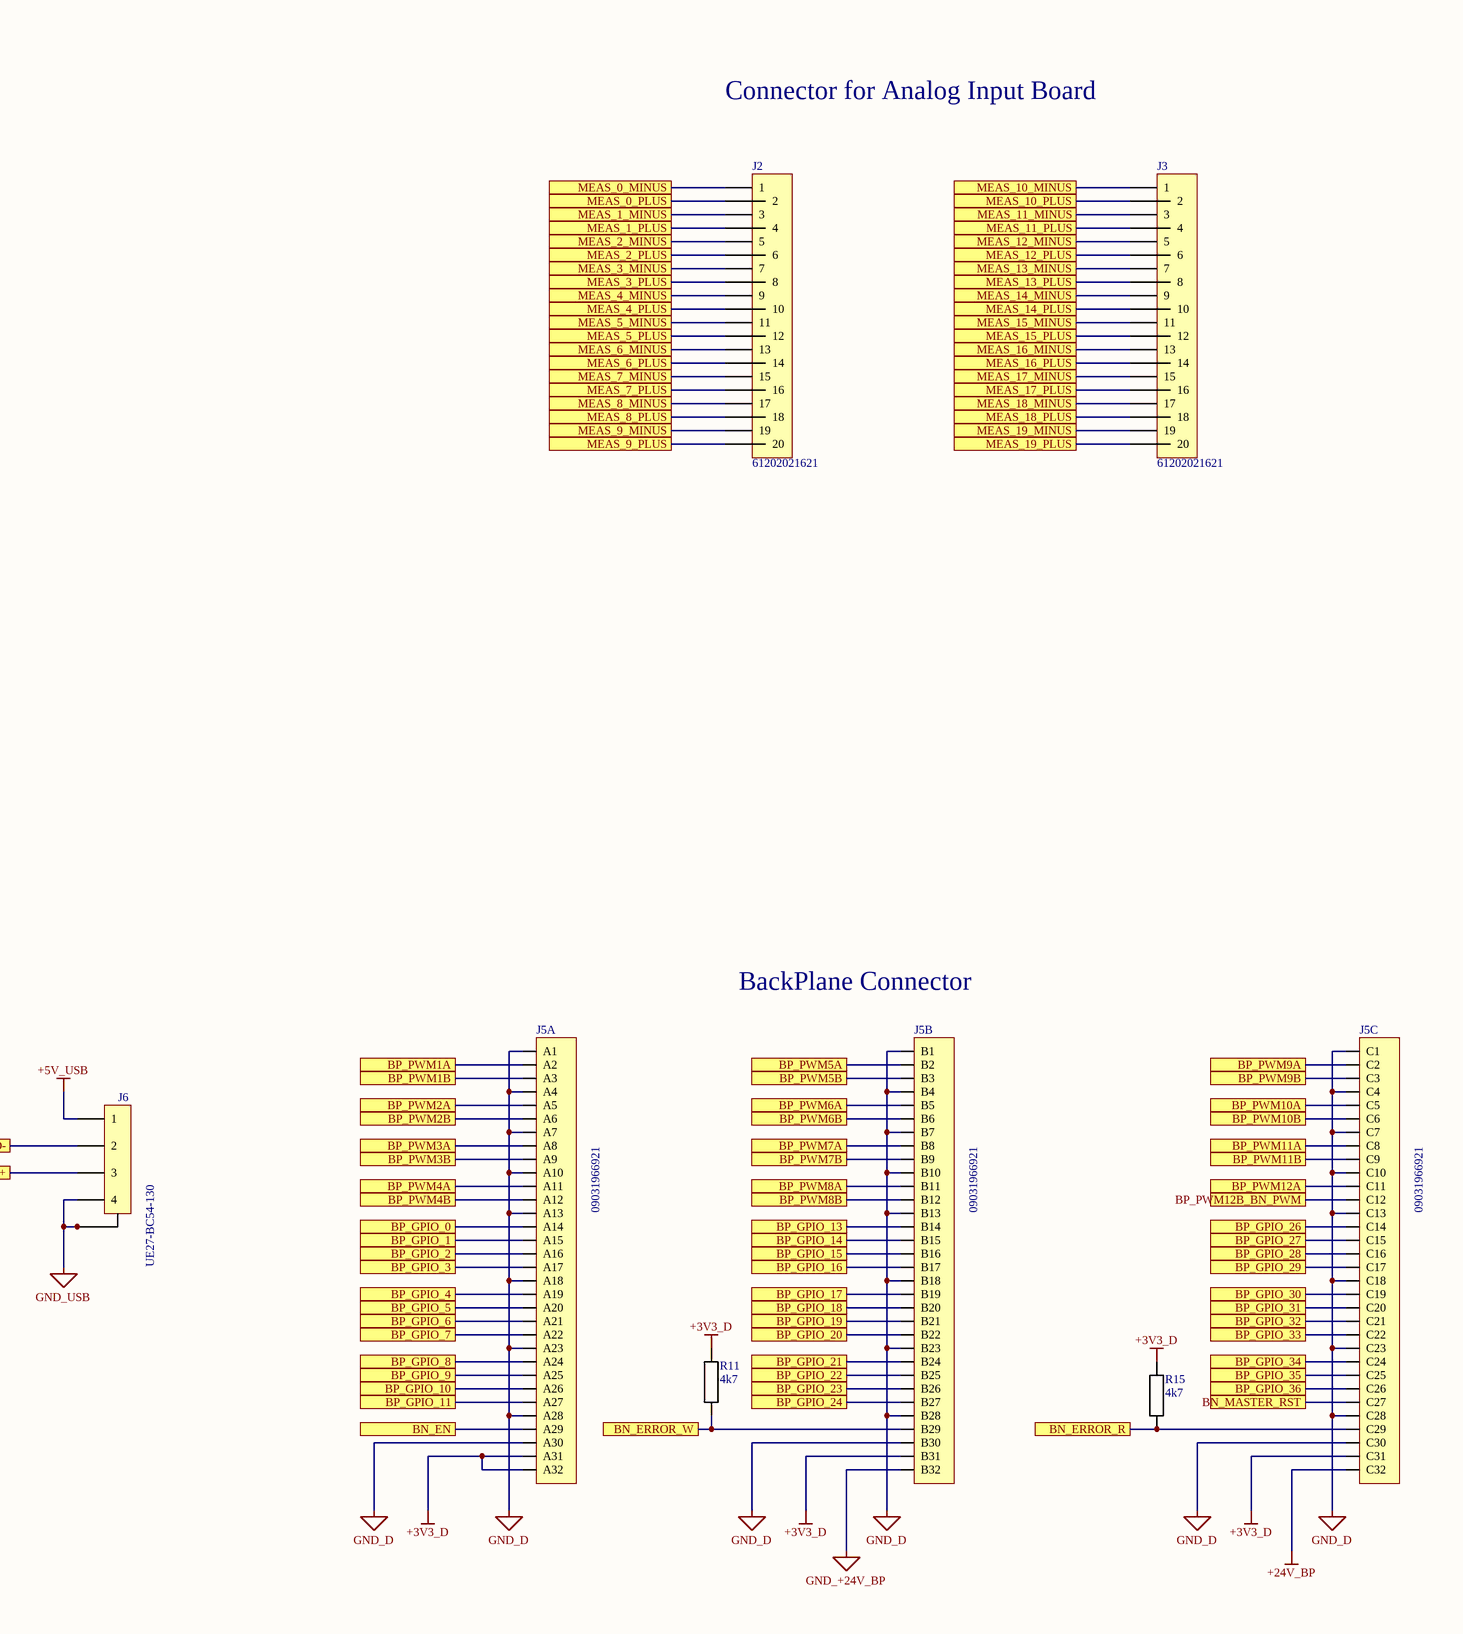
[diagram p7: Connector_0.SchDoc, right]

### Parts
C63  100n  [CAPACITOR 1608 REFLOW]
C64  100n  [CAPACITOR 1608 REFLOW]
C65  4u7  [CAPACITOR 2012 REFLOW]
C66  100n  [CAPACITOR 1608 REFLOW]
C67  4u7  [CAPACITOR 2012 REFLOW]
C68  100n  [CAPACITOR 1608 REFLOW]
J2  61202021621  [FlatCable2x10 2.54MM Straight TH]
J3  61202021621  [FlatCable2x10 2.54MM Straight TH]
J4  *  [PinHeader2x11 P2.54 A]  (value not drawn)
J5  09031966921  [DIN41612 MALE 3X32 ABC R90]  (parts A,B,C of 3)
J6  UE27-BC54-130  [USB-B TH AMPHENOL UE27-BC54-130]
LD1  Green  [LED 2012 REFLOW]
LD2  Green  [LED 2012 REFLOW]
LD3  Green  [LED 2012 REFLOW]
R11  4k7  [RESISTOR 1608 REFLOW]
R15  4k7  [RESISTOR 1608 REFLOW]
R25  1k  [RESISTOR 1608 REFLOW]
R26  1k  [RESISTOR 1608 REFLOW]
R27  1k  [RESISTOR 1608 REFLOW]
R28  0  [RESISTOR 1608 REFLOW]
R29  1k  [RESISTOR 1608 REFLOW]
U6  SI8422AB-D-ISR  [SO8 P1.27 C4.0X5.0 H1.75]
U7  CP2102N-A01-GQFN28  [QFN28 P0.5 T3.4X3.4 C5.0X5.0 H0.8]

### Ports
BN_EN, BN_ERROR_R, BN_ERROR_W, BN_MASTER_RST, BP_GPIO_0, BP_GPIO_1, BP_GPIO_2, BP_GPIO_3, BP_GPIO_4, BP_GPIO_5, BP_GPIO_6, BP_GPIO_7, BP_GPIO_8, BP_GPIO_9, BP_GPIO_10, BP_GPIO_11, BP_GPIO_13, BP_GPIO_14, BP_GPIO_15, BP_GPIO_16, BP_GPIO_17, BP_GPIO_18, BP_GPIO_19, BP_GPIO_20, BP_GPIO_21, BP_GPIO_22, BP_GPIO_23, BP_GPIO_24, BP_GPIO_26, BP_GPIO_27, BP_GPIO_28, BP_GPIO_29, BP_GPIO_30, BP_GPIO_31, BP_GPIO_32, BP_GPIO_33, BP_GPIO_34, BP_GPIO_35, BP_GPIO_36, BP_PWM1A, BP_PWM1B, BP_PWM2A, BP_PWM2B, BP_PWM3A, BP_PWM3B, BP_PWM4A, BP_PWM4B, BP_PWM5A, BP_PWM5B, BP_PWM6A, BP_PWM6B, BP_PWM7A, BP_PWM7B, BP_PWM8A, BP_PWM8B, BP_PWM9A, BP_PWM9B, BP_PWM10A, BP_PWM10B, BP_PWM11A, BP_PWM11B, BP_PWM12A, BP_PWM12B_BN_PWM, D+, D-, MEAS_0_MINUS, MEAS_0_PLUS, MEAS_1_MINUS, MEAS_1_PLUS, MEAS_2_MINUS, MEAS_2_PLUS, MEAS_3_MINUS, MEAS_3_PLUS, MEAS_4_MINUS, MEAS_4_PLUS, MEAS_5_MINUS, MEAS_5_PLUS, MEAS_6_MINUS, MEAS_6_PLUS, MEAS_7_MINUS, MEAS_7_PLUS, MEAS_8_MINUS, MEAS_8_PLUS, MEAS_9_MINUS, MEAS_9_PLUS, MEAS_10_MINUS, MEAS_10_PLUS, MEAS_11_MINUS, MEAS_11_PLUS, MEAS_12_MINUS, MEAS_12_PLUS, MEAS_13_MINUS, MEAS_13_PLUS, MEAS_14_MINUS, MEAS_14_PLUS, MEAS_15_MINUS, MEAS_15_PLUS, MEAS_16_MINUS, MEAS_16_PLUS, MEAS_17_MINUS, MEAS_17_PLUS, MEAS_18_MINUS, MEAS_18_PLUS, MEAS_19_MINUS, MEAS_19_PLUS, SCIA_RX, SCIA_TX, SCIC_RX, SCIC_TX, Spare_0, Spare_1, Spare_2, Spare_3, Spare_4, Spare_5, Spare_6, SPIA_CLK, SPIA_SIMO, SPIA_SOMI, SPIC_CLK, SPIC_SIMO, SPIC_SOMI, USB_RX, USB_TX, ~{SPIA_STE}, ~{SPIC_STE}

### Nets
+3V3_D: C63.2 J4.20 J5.A31 J5.A32 J5.B31 J5.C31 R11.2 R15.2 U6.1(VDD1)
+3V3_USB: C64.2 C67.2 C68.2 R25.2 R26.2 R27.2 U6.8(VDD2) U7.6(VDD)
+5V_USB: C65.2 C66.2 J6.1 R28.1 U7.8(VBUS)
+24V_BP: J4.1 J5.C32
GND_+24V_BP: J4.2 J5.B32
GND_D: C63.1 J4.21 J4.22 J5.A1 J5.A4 J5.A7 J5.A10 J5.A13 J5.A18 J5.A23 J5.A28 J5.A30 J5.B1 J5.B4 J5.B7 J5.B10 J5.B13 J5.B18 J5.B23 J5.B28 J5.B30 J5.C1 J5.C4 J5.C7 J5.C10 J5.C13 J5.C18 J5.C23 J5.C28 J5.C30 U6.4(GND1)
GND_USB: C64.1 C65.1 C66.1 C67.1 C68.1 J6.4 J6.5 J6.6 LD3.1(C) U6.5(GND2) U7.0(TP) U7.3(GND)
~{SPIA_STE}: J4.5 ; port ~{SPIA_STE}
~{SPIC_STE}: J4.7 ; port ~{SPIC_STE}
BN_EN: J5.A29 ; port BN_EN
BN_ERROR_R: J5.C29 R15.1 ; port BN_ERROR_R
BN_ERROR_W: J5.B29 R11.1 ; port BN_ERROR_W
BN_MASTER_RST: J5.C27 ; port BN_MASTER_RST
BP_GPIO_0: J5.A14 ; port BP_GPIO_0
BP_GPIO_1: J5.A15 ; port BP_GPIO_1
BP_GPIO_2: J5.A16 ; port BP_GPIO_2
BP_GPIO_3: J5.A17 ; port BP_GPIO_3
BP_GPIO_4: J5.A19 ; port BP_GPIO_4
BP_GPIO_5: J5.A20 ; port BP_GPIO_5
BP_GPIO_6: J5.A21 ; port BP_GPIO_6
BP_GPIO_7: J5.A22 ; port BP_GPIO_7
BP_GPIO_8: J5.A24 ; port BP_GPIO_8
BP_GPIO_9: J5.A25 ; port BP_GPIO_9
BP_GPIO_10: J5.A26 ; port BP_GPIO_10
BP_GPIO_11: J5.A27 ; port BP_GPIO_11
BP_GPIO_13: J5.B14 ; port BP_GPIO_13
BP_GPIO_14: J5.B15 ; port BP_GPIO_14
BP_GPIO_15: J5.B16 ; port BP_GPIO_15
BP_GPIO_16: J5.B17 ; port BP_GPIO_16
BP_GPIO_17: J5.B19 ; port BP_GPIO_17
BP_GPIO_18: J5.B20 ; port BP_GPIO_18
BP_GPIO_19: J5.B21 ; port BP_GPIO_19
BP_GPIO_20: J5.B22 ; port BP_GPIO_20
BP_GPIO_21: J5.B24 ; port BP_GPIO_21
BP_GPIO_22: J5.B25 ; port BP_GPIO_22
BP_GPIO_23: J5.B26 ; port BP_GPIO_23
BP_GPIO_24: J5.B27 ; port BP_GPIO_24
BP_GPIO_26: J5.C14 ; port BP_GPIO_26
BP_GPIO_27: J5.C15 ; port BP_GPIO_27
BP_GPIO_28: J5.C16 ; port BP_GPIO_28
BP_GPIO_29: J5.C17 ; port BP_GPIO_29
BP_GPIO_30: J5.C19 ; port BP_GPIO_30
BP_GPIO_31: J5.C20 ; port BP_GPIO_31
BP_GPIO_32: J5.C21 ; port BP_GPIO_32
BP_GPIO_33: J5.C22 ; port BP_GPIO_33
BP_GPIO_34: J5.C24 ; port BP_GPIO_34
BP_GPIO_35: J5.C25 ; port BP_GPIO_35
BP_GPIO_36: J5.C26 ; port BP_GPIO_36
BP_PWM1A: J5.A2 ; port BP_PWM1A
BP_PWM1B: J5.A3 ; port BP_PWM1B
BP_PWM2A: J5.A5 ; port BP_PWM2A
BP_PWM2B: J5.A6 ; port BP_PWM2B
BP_PWM3A: J5.A8 ; port BP_PWM3A
BP_PWM3B: J5.A9 ; port BP_PWM3B
BP_PWM4A: J5.A11 ; port BP_PWM4A
BP_PWM4B: J5.A12 ; port BP_PWM4B
BP_PWM5A: J5.B2 ; port BP_PWM5A
BP_PWM5B: J5.B3 ; port BP_PWM5B
BP_PWM6A: J5.B5 ; port BP_PWM6A
BP_PWM6B: J5.B6 ; port BP_PWM6B
BP_PWM7A: J5.B8 ; port BP_PWM7A
BP_PWM7B: J5.B9 ; port BP_PWM7B
BP_PWM8A: J5.B11 ; port BP_PWM8A
BP_PWM8B: J5.B12 ; port BP_PWM8B
BP_PWM9A: J5.C2 ; port BP_PWM9A
BP_PWM9B: J5.C3 ; port BP_PWM9B
BP_PWM10A: J5.C5 ; port BP_PWM10A
BP_PWM10B: J5.C6 ; port BP_PWM10B
BP_PWM11A: J5.C8 ; port BP_PWM11A
BP_PWM11B: J5.C9 ; port BP_PWM11B
BP_PWM12A: J5.C11 ; port BP_PWM12A
BP_PWM12B_BN_PWM: J5.C12 ; port BP_PWM12B_BN_PWM
D+: J6.3 U7.4(D+) ; port D+
D-: J6.2 U7.5(D-) ; port D-
MEAS_0_MINUS: J2.1 ; port MEAS_0_MINUS
MEAS_0_PLUS: J2.2 ; port MEAS_0_PLUS
MEAS_1_MINUS: J2.3 ; port MEAS_1_MINUS
MEAS_1_PLUS: J2.4 ; port MEAS_1_PLUS
MEAS_2_MINUS: J2.5 ; port MEAS_2_MINUS
MEAS_2_PLUS: J2.6 ; port MEAS_2_PLUS
MEAS_3_MINUS: J2.7 ; port MEAS_3_MINUS
MEAS_3_PLUS: J2.8 ; port MEAS_3_PLUS
MEAS_4_MINUS: J2.9 ; port MEAS_4_MINUS
MEAS_4_PLUS: J2.10 ; port MEAS_4_PLUS
MEAS_5_MINUS: J2.11 ; port MEAS_5_MINUS
MEAS_5_PLUS: J2.12 ; port MEAS_5_PLUS
MEAS_6_MINUS: J2.13 ; port MEAS_6_MINUS
MEAS_6_PLUS: J2.14 ; port MEAS_6_PLUS
MEAS_7_MINUS: J2.15 ; port MEAS_7_MINUS
MEAS_7_PLUS: J2.16 ; port MEAS_7_PLUS
MEAS_8_MINUS: J2.17 ; port MEAS_8_MINUS
MEAS_8_PLUS: J2.18 ; port MEAS_8_PLUS
MEAS_9_MINUS: J2.19 ; port MEAS_9_MINUS
MEAS_9_PLUS: J2.20 ; port MEAS_9_PLUS
MEAS_10_MINUS: J3.1 ; port MEAS_10_MINUS
MEAS_10_PLUS: J3.2 ; port MEAS_10_PLUS
MEAS_11_MINUS: J3.3 ; port MEAS_11_MINUS
MEAS_11_PLUS: J3.4 ; port MEAS_11_PLUS
MEAS_12_MINUS: J3.5 ; port MEAS_12_MINUS
MEAS_12_PLUS: J3.6 ; port MEAS_12_PLUS
MEAS_13_MINUS: J3.7 ; port MEAS_13_MINUS
MEAS_13_PLUS: J3.8 ; port MEAS_13_PLUS
MEAS_14_MINUS: J3.9 ; port MEAS_14_MINUS
MEAS_14_PLUS: J3.10 ; port MEAS_14_PLUS
MEAS_15_MINUS: J3.11 ; port MEAS_15_MINUS
MEAS_15_PLUS: J3.12 ; port MEAS_15_PLUS
MEAS_16_MINUS: J3.13 ; port MEAS_16_MINUS
MEAS_16_PLUS: J3.14 ; port MEAS_16_PLUS
MEAS_17_MINUS: J3.15 ; port MEAS_17_MINUS
MEAS_17_PLUS: J3.16 ; port MEAS_17_PLUS
MEAS_18_MINUS: J3.17 ; port MEAS_18_MINUS
MEAS_18_PLUS: J3.18 ; port MEAS_18_PLUS
MEAS_19_MINUS: J3.19 ; port MEAS_19_MINUS
MEAS_19_PLUS: J3.20 ; port MEAS_19_PLUS
SCIA_RX: U6.2(A1) ; port SCIA_RX
SCIA_TX: U6.3(A2) ; port SCIA_TX
SCIC_RX: J4.11 ; port SCIC_RX
SCIC_TX: J4.12 ; port SCIC_TX
Spare_0: J4.13 ; port Spare_0
Spare_1: J4.14 ; port Spare_1
Spare_2: J4.15 ; port Spare_2
Spare_3: J4.16 ; port Spare_3
Spare_4: J4.17 ; port Spare_4
Spare_5: J4.18 ; port Spare_5
Spare_6: J4.19 ; port Spare_6
SPIA_CLK: J4.6 ; port SPIA_CLK
SPIA_SIMO: J4.4 ; port SPIA_SIMO
SPIA_SOMI: J4.3 ; port SPIA_SOMI
SPIC_CLK: J4.8 ; port SPIC_CLK
SPIC_SIMO: J4.10 ; port SPIC_SIMO
SPIC_SOMI: J4.9 ; port SPIC_SOMI
USB_RX: LD2.1(C) U6.6(B2) U7.25(RXD) ; port USB_RX
USB_TX: LD1.1(C) U6.7(B1) U7.26(TXD) ; port USB_TX
NetLD1_2: LD1.2(A) R25.1
NetLD2_2: LD2.2(A) R26.1
NetLD3_2: LD3.2(A) R29.1
NetR27_1: R27.1 U7.9(RTSb)
NetR28_2: R28.2 U7.7(VREGIN)
NetR29_2: R29.2 U7.11(SUSPENDb)

Not connected (* = marked no-connect by the designer): U7 1(DCD)* 2(RI/CLK)* 10(NC)* 12(SUSPEND)* 13(CHREN)* 14(CHR1)* 15(CHR0)* 16(GPIO3/WAKEUP)* 17(GPIO2/RS485)* 18(GPIO1/RXT)* 19(GPIO0/TXT)* 20(GPIO6)* 21(GPIO5)* 22(GPIO4)* 23(CTS)* 24(RTS)* 27(DSR)* 28(DTR)*

### Notes on the sheet
- DSP to Mezzazzine board
- Connector for Analog Input Board
- SPI-A for 4 Channels DAC
- UART-C
- SPI-C
- Spare CPLD
- UART-A  DSP Control Center
- BackPlane Connector
- Date :
- Revision :
- Sheet
- of
- Design by :

### Library data of the parts
C63 C64 C66 C68 = Capacitor: Capacitor X7R 10% 50V 1608(0603); Value: 100n
C65 C67 = Capacitor: Capacitor X7R 10% 10V 2012(0805); Value: 4u7
J2 J3 = FlatCable2x10: Manufacturer: Wurth Elektronik; Mouser No.: 710-61202021621; Value: 61202021621
J4 = PinHeader2x11: Plug connector; Value: *
J5 = DIN41612 MALE 3X32 ABC R90: Manufacturer: Harting; Mouser No.: 617-09-03-196-6921; Value: 09031966921
J6 = USB-B-TH-AMPHENOL UE27-BC54-130: Manufacturer: Amphenol ICC; Mouser No.: 523-UE27-BC54-130; Value: UE27-BC54-130
LD1-LD3 = LED: LED generic; Value: Green
R11 R15 R25-R29 = Resistor: Resistor 1% 50V 100mW 1608(0603)
  R11 R15: Value: 4k7
  R25-R27 R29: Value: 1k
  R28: Value: 0
U6 = SI8422: Optocoupler; Manufacturer: Silicon Labs; Value: SI8422AB-D-ISR; Mouser No.: 634-SI8422AB-D-ISR
U7 = CP2102N: USBXpress; Manufacturer: Silicon Labs; Value: CP2102N-A01-GQFN28; Mouser No.: 634-CP2102NA01GQFN28

## Sheet AD_0.SchDoc
size A2; Date: Date; CompanyName: HESSO; Engineer: Name; Address1: Route du Rawyl 47; Address2: 1950 Sion; Address3: Switzerland; DocumentNumber: 5; SheetNumber: 5; SheetTotal: 8; ProjectName: Project Name
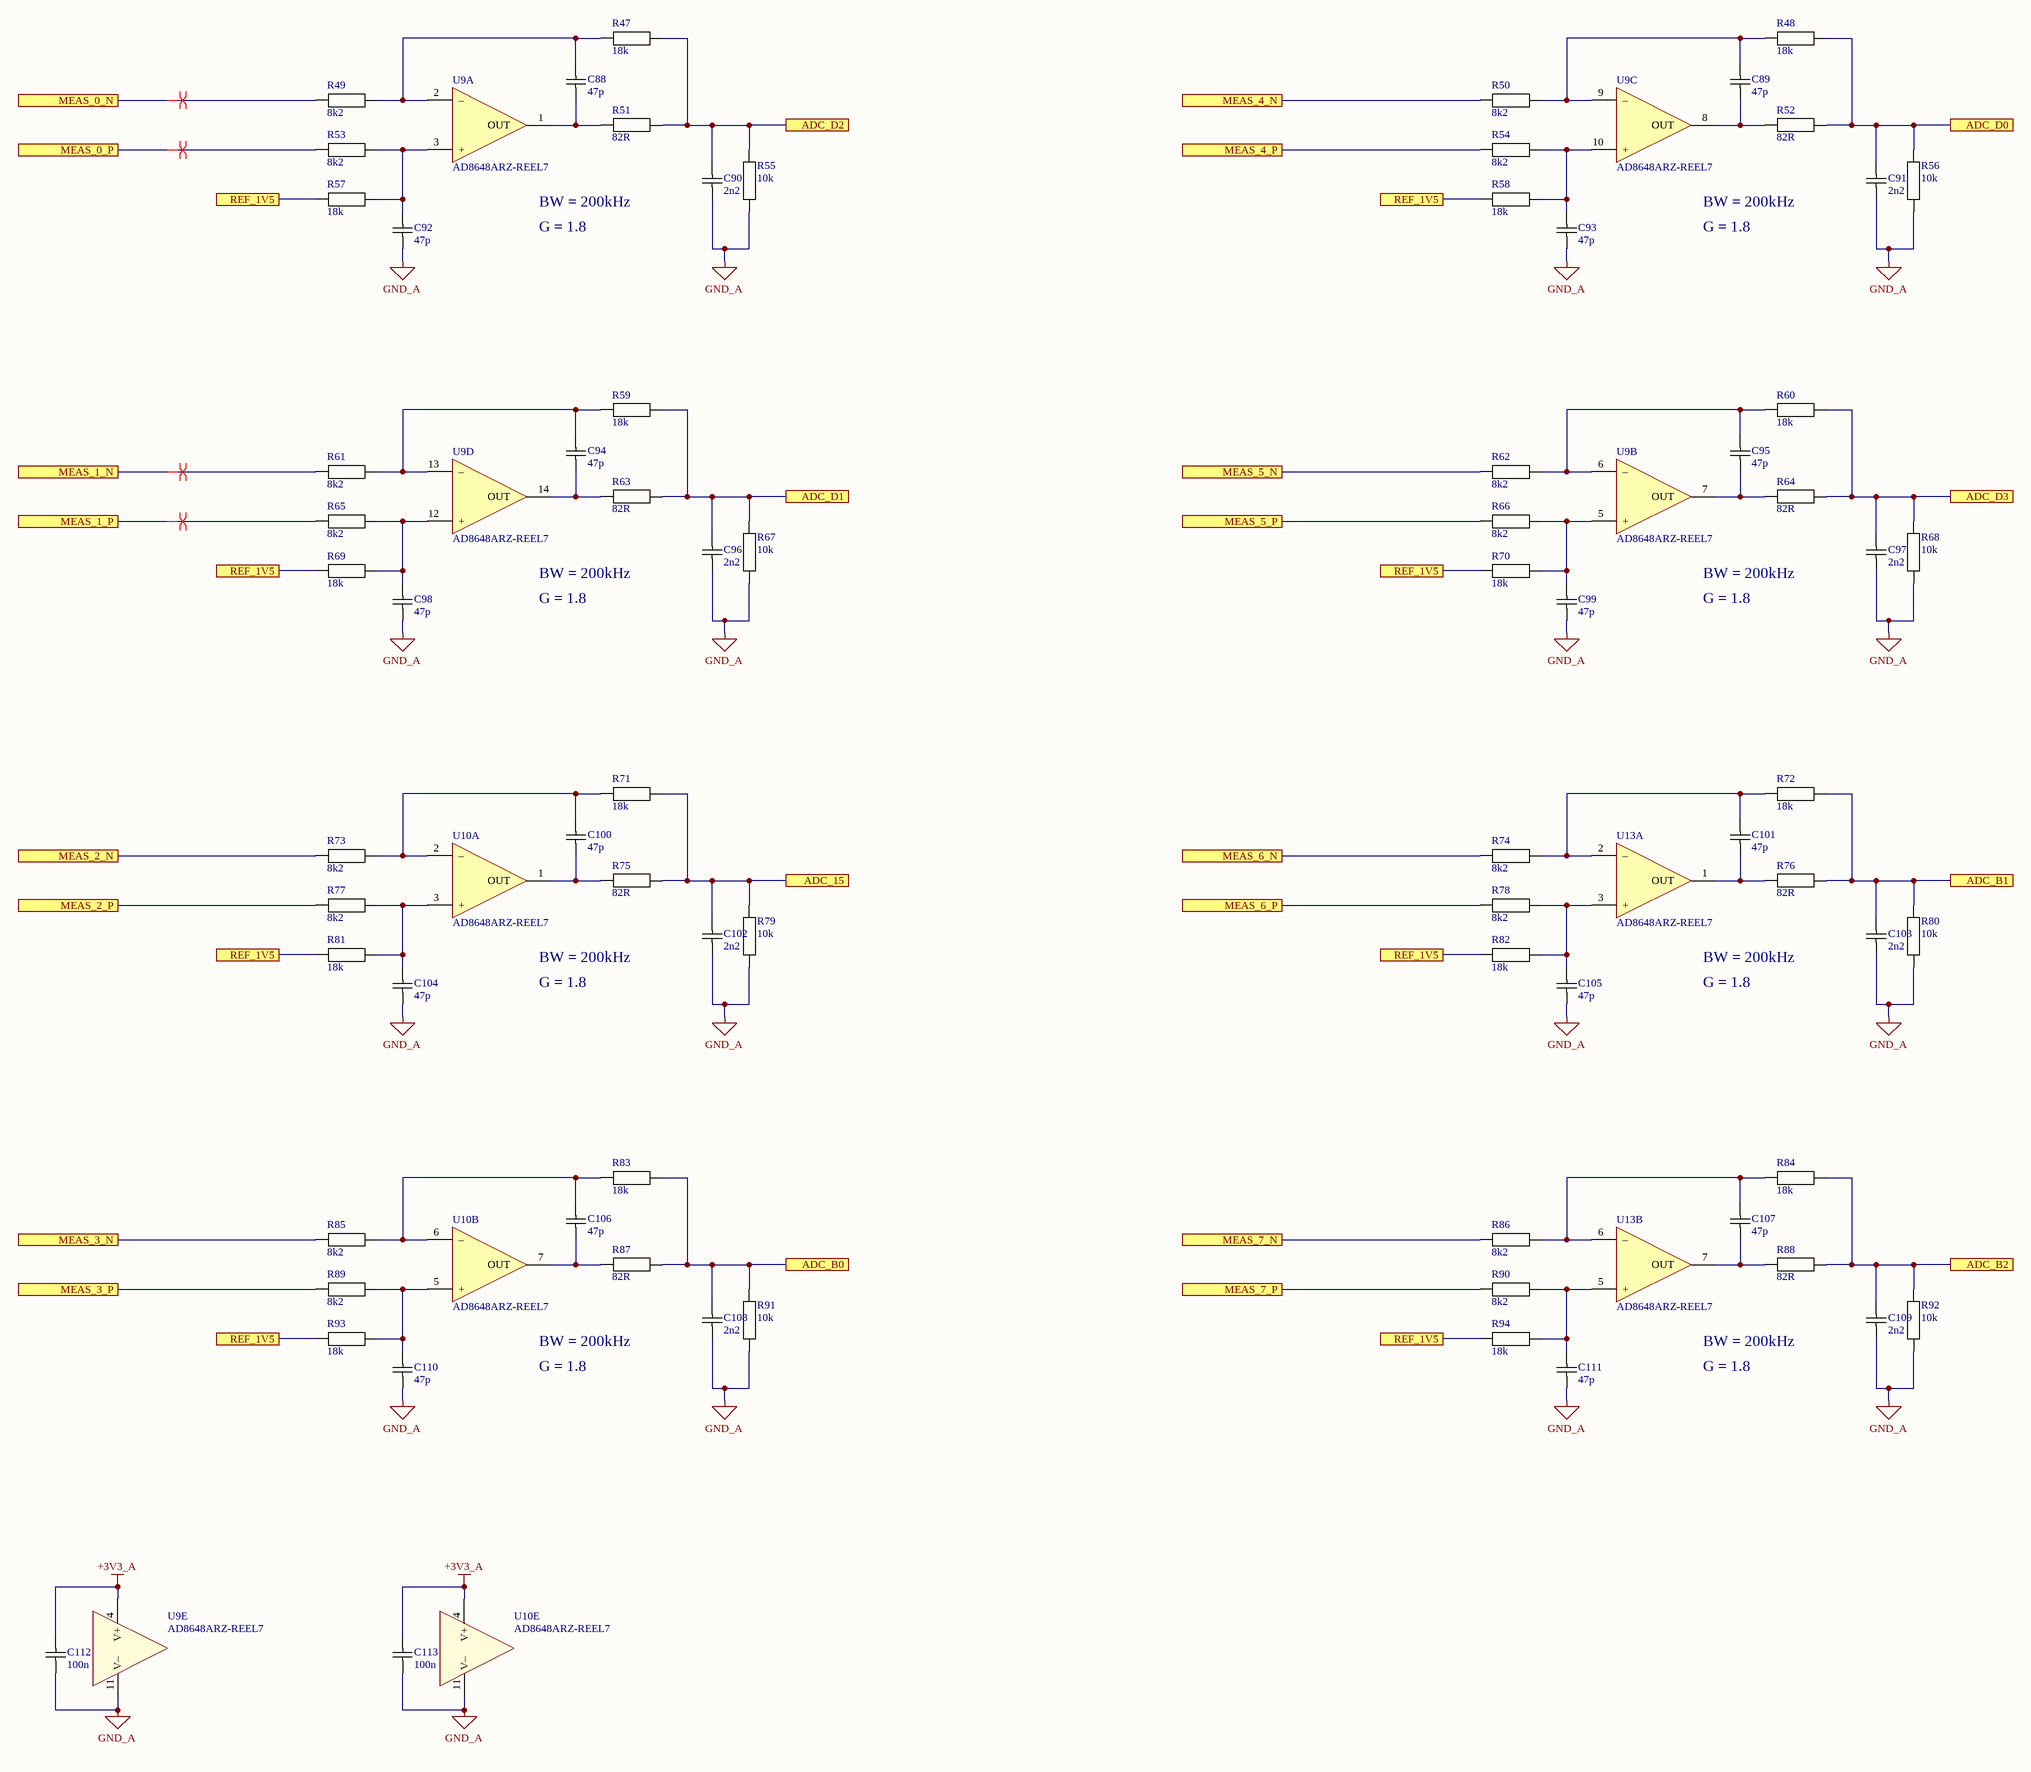
[diagram p8: AD_0.SchDoc]

### Parts
C88  47p  [CAPACITOR 1608 REFLOW]
C89  47p  [CAPACITOR 1608 REFLOW]
C90  2n2  [CAPACITOR 1608 REFLOW]
C91  2n2  [CAPACITOR 1608 REFLOW]
C92  47p  [CAPACITOR 1608 REFLOW]
C93  47p  [CAPACITOR 1608 REFLOW]
C94  47p  [CAPACITOR 1608 REFLOW]
C95  47p  [CAPACITOR 1608 REFLOW]
C96  2n2  [CAPACITOR 1608 REFLOW]
C97  2n2  [CAPACITOR 1608 REFLOW]
C98  47p  [CAPACITOR 1608 REFLOW]
C99  47p  [CAPACITOR 1608 REFLOW]
C100  47p  [CAPACITOR 1608 REFLOW]
C101  47p  [CAPACITOR 1608 REFLOW]
C102  2n2  [CAPACITOR 1608 REFLOW]
C103  2n2  [CAPACITOR 1608 REFLOW]
C104  47p  [CAPACITOR 1608 REFLOW]
C105  47p  [CAPACITOR 1608 REFLOW]
C106  47p  [CAPACITOR 1608 REFLOW]
C107  47p  [CAPACITOR 1608 REFLOW]
C108  2n2  [CAPACITOR 1608 REFLOW]
C109  2n2  [CAPACITOR 1608 REFLOW]
C110  47p  [CAPACITOR 1608 REFLOW]
C111  47p  [CAPACITOR 1608 REFLOW]
C112  100n  [CAPACITOR 1608 REFLOW]
C113  100n  [CAPACITOR 1608 REFLOW]
R47  18k  [RESISTOR 1608 REFLOW]
R48  18k  [RESISTOR 1608 REFLOW]
R49  8k2  [RESISTOR 1608 REFLOW]
R50  8k2  [RESISTOR 1608 REFLOW]
R51  82R  [RESISTOR 1608 REFLOW]
R52  82R  [RESISTOR 1608 REFLOW]
R53  8k2  [RESISTOR 1608 REFLOW]
R54  8k2  [RESISTOR 1608 REFLOW]
R55  10k  [RESISTOR 1608 REFLOW]
R56  10k  [RESISTOR 1608 REFLOW]
R57  18k  [RESISTOR 1608 REFLOW]
R58  18k  [RESISTOR 1608 REFLOW]
R59  18k  [RESISTOR 1608 REFLOW]
R60  18k  [RESISTOR 1608 REFLOW]
R61  8k2  [RESISTOR 1608 REFLOW]
R62  8k2  [RESISTOR 1608 REFLOW]
R63  82R  [RESISTOR 1608 REFLOW]
R64  82R  [RESISTOR 1608 REFLOW]
R65  8k2  [RESISTOR 1608 REFLOW]
R66  8k2  [RESISTOR 1608 REFLOW]
R67  10k  [RESISTOR 1608 REFLOW]
R68  10k  [RESISTOR 1608 REFLOW]
R69  18k  [RESISTOR 1608 REFLOW]
R70  18k  [RESISTOR 1608 REFLOW]
R71  18k  [RESISTOR 1608 REFLOW]
R72  18k  [RESISTOR 1608 REFLOW]
R73  8k2  [RESISTOR 1608 REFLOW]
R74  8k2  [RESISTOR 1608 REFLOW]
R75  82R  [RESISTOR 1608 REFLOW]
R76  82R  [RESISTOR 1608 REFLOW]
R77  8k2  [RESISTOR 1608 REFLOW]
R78  8k2  [RESISTOR 1608 REFLOW]
R79  10k  [RESISTOR 1608 REFLOW]
R80  10k  [RESISTOR 1608 REFLOW]
R81  18k  [RESISTOR 1608 REFLOW]
R82  18k  [RESISTOR 1608 REFLOW]
R83  18k  [RESISTOR 1608 REFLOW]
R84  18k  [RESISTOR 1608 REFLOW]
R85  8k2  [RESISTOR 1608 REFLOW]
R86  8k2  [RESISTOR 1608 REFLOW]
R87  82R  [RESISTOR 1608 REFLOW]
R88  82R  [RESISTOR 1608 REFLOW]
R89  8k2  [RESISTOR 1608 REFLOW]
R90  8k2  [RESISTOR 1608 REFLOW]
R91  10k  [RESISTOR 1608 REFLOW]
R92  10k  [RESISTOR 1608 REFLOW]
R93  18k  [RESISTOR 1608 REFLOW]
R94  18k  [RESISTOR 1608 REFLOW]
U9  AD8648ARZ-REEL7  [SO14 P1.27 C4.0X8.8 H1.75]  (parts A,B,C,D,E of 5)
U10  AD8648ARZ-REEL7  [SO14 P1.27 C4.0X8.8 H1.75]  (parts A,B,E of 5)
U13  AD8648ARZ-REEL7  [SO14 P1.27 C4.0X8.8 H1.75]  (parts A,B of 5)

### Ports
ADC_15, ADC_B0, ADC_B1, ADC_B2, ADC_D0, ADC_D1, ADC_D2, ADC_D3, MEAS_0_N, MEAS_0_P, MEAS_1_N, MEAS_1_P, MEAS_2_N, MEAS_2_P, MEAS_3_N, MEAS_3_P, MEAS_4_N, MEAS_4_P, MEAS_5_N, MEAS_5_P, MEAS_6_N, MEAS_6_P, MEAS_7_N, MEAS_7_P, REF_1V5

### Nets
+3V3_A: C112.2 C113.2 U9.4(V+) U10.4(V+)
GND_A: C90.1 C91.1 C92.1 C93.1 C96.1 C97.1 C98.1 C99.1 C102.1 C103.1 C104.1 C105.1 C108.1 C109.1 C110.1 C111.1 C112.1 C113.1 R55.2 R56.2 R67.2 R68.2 R79.2 R80.2 R91.2 R92.2 U9.11(V–) U10.11(V–)
ADC_15: C102.2 R71.2 R75.2 R79.1 ; port ADC_15
ADC_B0: C108.2 R83.2 R87.2 R91.1 ; port ADC_B0
ADC_B1: C103.2 R72.2 R76.2 R80.1 ; port ADC_B1
ADC_B2: C109.2 R84.2 R88.2 R92.1 ; port ADC_B2
ADC_D0: C91.2 R48.2 R52.2 R56.1 ; port ADC_D0
ADC_D1: C96.2 R59.2 R63.2 R67.1 ; port ADC_D1
ADC_D2: C90.2 R47.2 R51.2 R55.1 ; port ADC_D2
ADC_D3: C97.2 R60.2 R64.2 R68.1 ; port ADC_D3
MEAS_0_N: R49.1 ; port MEAS_0_N
MEAS_0_P: R53.1 ; port MEAS_0_P
MEAS_1_N: R61.1 ; port MEAS_1_N
MEAS_1_P: R65.1 ; port MEAS_1_P
MEAS_2_N: R73.1 ; port MEAS_2_N
MEAS_2_P: R77.1 ; port MEAS_2_P
MEAS_3_N: R85.1 ; port MEAS_3_N
MEAS_3_P: R89.1 ; port MEAS_3_P
MEAS_4_N: R50.1 ; port MEAS_4_N
MEAS_4_P: R54.1 ; port MEAS_4_P
MEAS_5_N: R62.1 ; port MEAS_5_N
MEAS_5_P: R66.1 ; port MEAS_5_P
MEAS_6_N: R74.1 ; port MEAS_6_N
MEAS_6_P: R78.1 ; port MEAS_6_P
MEAS_7_N: R86.1 ; port MEAS_7_N
MEAS_7_P: R90.1 ; port MEAS_7_P
REF_1V5: R57.2 R58.2 R69.2 R70.2 R81.2 R82.2 R93.2 R94.2 ; port REF_1V5
NetC88_1: C88.1 R51.1 U9.1(OUT)
NetC88_2: C88.2 R47.1 R49.2 U9.2(–)
NetC89_1: C89.1 R52.1 U9.8(OUT)
NetC89_2: C89.2 R48.1 R50.2 U9.9(–)
NetC92_2: C92.2 R53.2 R57.1 U9.3(+)
NetC93_2: C93.2 R54.2 R58.1 U9.10(+)
NetC94_1: C94.1 R63.1 U9.14(OUT)
NetC94_2: C94.2 R59.1 R61.2 U9.13(–)
NetC95_1: C95.1 R64.1 U9.7(OUT)
NetC95_2: C95.2 R60.1 R62.2 U9.6(–)
NetC98_2: C98.2 R65.2 R69.1 U9.12(+)
NetC99_2: C99.2 R66.2 R70.1 U9.5(+)
NetC100_1: C100.1 R75.1 U10.1(OUT)
NetC100_2: C100.2 R71.1 R73.2 U10.2(–)
NetC101_1: C101.1 R76.1 U13.1(OUT)
NetC101_2: C101.2 R72.1 R74.2 U13.2(–)
NetC104_2: C104.2 R77.2 R81.1 U10.3(+)
NetC105_2: C105.2 R78.2 R82.1 U13.3(+)
NetC106_1: C106.1 R87.1 U10.7(OUT)
NetC106_2: C106.2 R83.1 R85.2 U10.6(–)
NetC107_1: C107.1 R88.1 U13.7(OUT)
NetC107_2: C107.2 R84.1 R86.2 U13.6(–)
NetC110_2: C110.2 R89.2 R93.1 U10.5(+)
NetC111_2: C111.2 R90.2 R94.1 U13.5(+)

### Layout directives
differential pair: MEAS_0_N, MEAS_0_P, MEAS_1_N, MEAS_1_P

### Notes on the sheet
- BW = 200kHz
- G = 1.8
- Date :
- Revision :
- Sheet
- of
- Design by :

### Library data of the parts
C88-C113 = Capacitor: Capacitor X7R 10% 50V 1608(0603)
  C88 C89 C92-C95 C98-C101 C104-C107 C110 C111: Value: 47p
  C90 C91 C96 C97 C102 C103 C108 C109: Value: 2n2
  C112 C113: Value: 100n
R47-R94 = Resistor: Resistor 1% 50V 100mW 1608(0603)
  R47 R48 R57-R60 R69-R72 R81-R84 R93 R94: Value: 18k
  R49 R50 R53 R54 R61 R62 R65 R66 R73 R74 R77 R78 R85 R86 R89 R90: Value: 8k2
  R51 R52 R63 R64 R75 R76 R87 R88: Value: 82R
  R55 R56 R67 R68 R79 R80 R91 R92: Value: 10k
U9 U10 U13 = OPA QUAD: Generic quad OPA 14 pins; Manufacturer: Analog Devices; Value: AD8648ARZ-REEL7; Mouser No.: 584-AD8648ARZ-R7